# EAGLE design Mergen Ground Station_V2.0 (EAGLE 9.6.2)

## Sheet 1 of 5
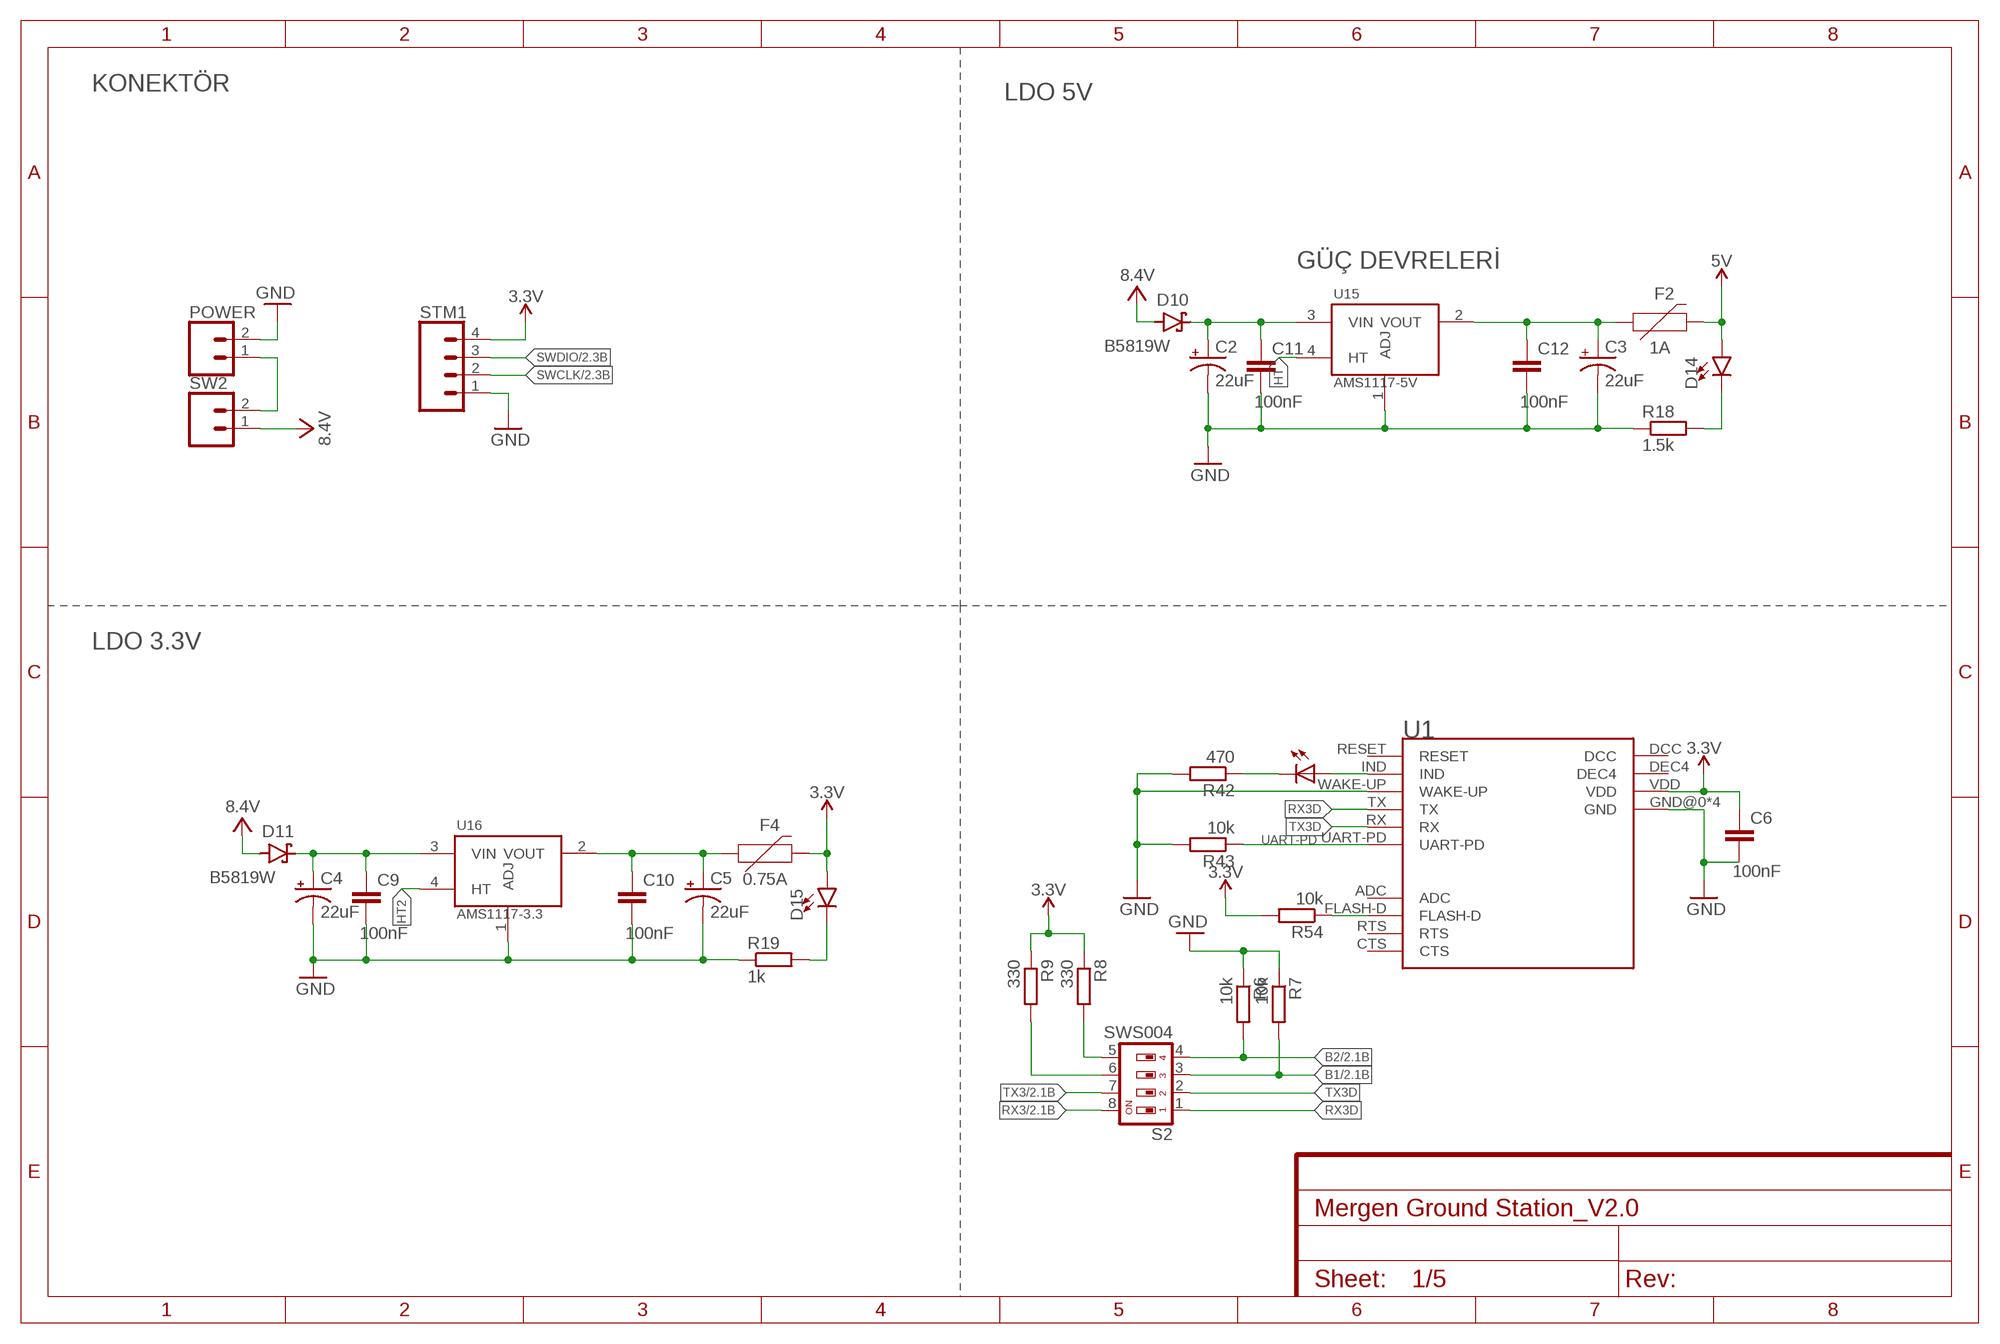
[diagram p0: schematic, sheet 1]

### Parts
C2  22uF  CPOL-USCT3528  [CT3528]
C3  22uF  CPOL-USCT3528  [CT3528]
C4  22uF  CPOL-USCT3528  [CT3528]
C5  22uF  CPOL-USCT3528  [CT3528]
C6  100nF  C-EUC0603  [C0603]
C9  100nF  C-EUC0603  [C0603]
C10  100nF  C-EUC0603  [C0603]
C11  100nF  C-EUC0603  [C0603]
C12  100nF  C-EUC0603  [C0603]
D10  B5819W  SCHOTTKY_MBR0520LT1GDO-219  [SODFL3718X115]
D11  B5819W  SCHOTTKY_MBR0520LT1GDO-219  [SODFL3718X115]
D14  LED0603  [LED-0603]
D15  LED0603  [LED-0603]
DRM3  kirmizi  LEDCHIP-LED0805  [CHIP-LED0805]
F2  1A  PPTC_HALF-AMP  [1206]
F4  0.75A  PPTC_HALF-AMP  [1206]
POWER  CONN_023.5MM-NO_SILK  [SCREWTERMINAL-3.5MM-2-NS]
R6  10k  R-EU_R0603  [R0603]
R7  10k  R-EU_R0603  [R0603]
R8  330  R-EU_R0603  [R0603]
R9  330  R-EU_R0603  [R0603]
R18  1.5k  R-EU_R0603  [R0603]
R19  1k  R-EU_R0603  [R0603]
R42  470  R-EU_R0603  [R0603]
R43  10k  R-EU_R0603  [R0603]
R54  10k  R-EU_R0603  [R0603]
S2  SWS004  [SMS-004]
STM1  CONN_04  [1X04]
SW2  CONN_023.5MM-NO_SILK  [SCREWTERMINAL-3.5MM-2-NS]
U1  MDBT42T-AT  [MDBT42T-AT]
U15  AMS1117-5V  AMS1117-3.3  [SOT229P700X180-4N]
U16  AMS1117-3.3  [SOT229P700X180-4N]

### Nets
3.3V: C6.1 D15.A F4.2 R8.1 R9.1 R54.2 STM1.4 U1.VDD ; also sheet 2,3,5
5V: D14.A F2.2 ; also sheet 4,5
B1: R7.2 S2.3 ; also sheet 2
B2: R6.2 S2.4 ; also sheet 2
FLASH-D: R54.1 U1.FLASH-D ; also sheet 2
GND: C2.- C3.- C4.- C5.- C6.2 C9.2 C10.2 C11.2 C12.2 POWER.2 R6.1 R7.1 R18.1 R19.1 R42.2 R43.2 STM1.1 U1.GND@0(GND) U1.GND@1(GND) U1.GND@2(GND) U1.GND@3(GND) U1.WAKE-UP U15.1(ADJ) U16.1(ADJ) ; also sheet 2,3,4,5
HT: U15.4(HT)
HT2: U16.4(HT)
N$5: DRM3.A U1.IND
N$6: DRM3.C R42.1
N$7: R9.2 S2.6
N$8: R8.2 S2.5
N$22: C2.+ C11.1 D10.1(C) U15.3(VIN)
N$23: C3.+ C12.1 F2.1 U15.2(VOUT)
N$24: C4.+ C9.1 D11.1(C) U16.3(VIN)
N$25: C5.+ C10.1 F4.1 U16.2(VOUT)
N$30: POWER.1 SW2.2
N$35: D14.C R18.2
N$36: D15.C R19.2
RX3: S2.8 ; also sheet 2,5
RX3D: S2.1 U1.TX
SWCLK: STM1.2 ; also sheet 2
SWDIO: STM1.3 ; also sheet 2
TX3: S2.7 ; also sheet 2,5
TX3D: S2.2 U1.RX
UART-PD: R43.1 U1.UART-PD ; also sheet 2
VCC: D10.2(A) D11.2(A) SW2.1 ; supply symbol labelled 8.4V ; also sheet 2,5
Unconnected: U1.ADC U1.CTS U1.DCC U1.DEC4 U1.RESET U1.RTS

### Notes on the sheet
- KONEKTÖR
- LDO 5V
- GÜÇ DEVRELERİ
- LDO 3.3V

## Sheet 2 of 5
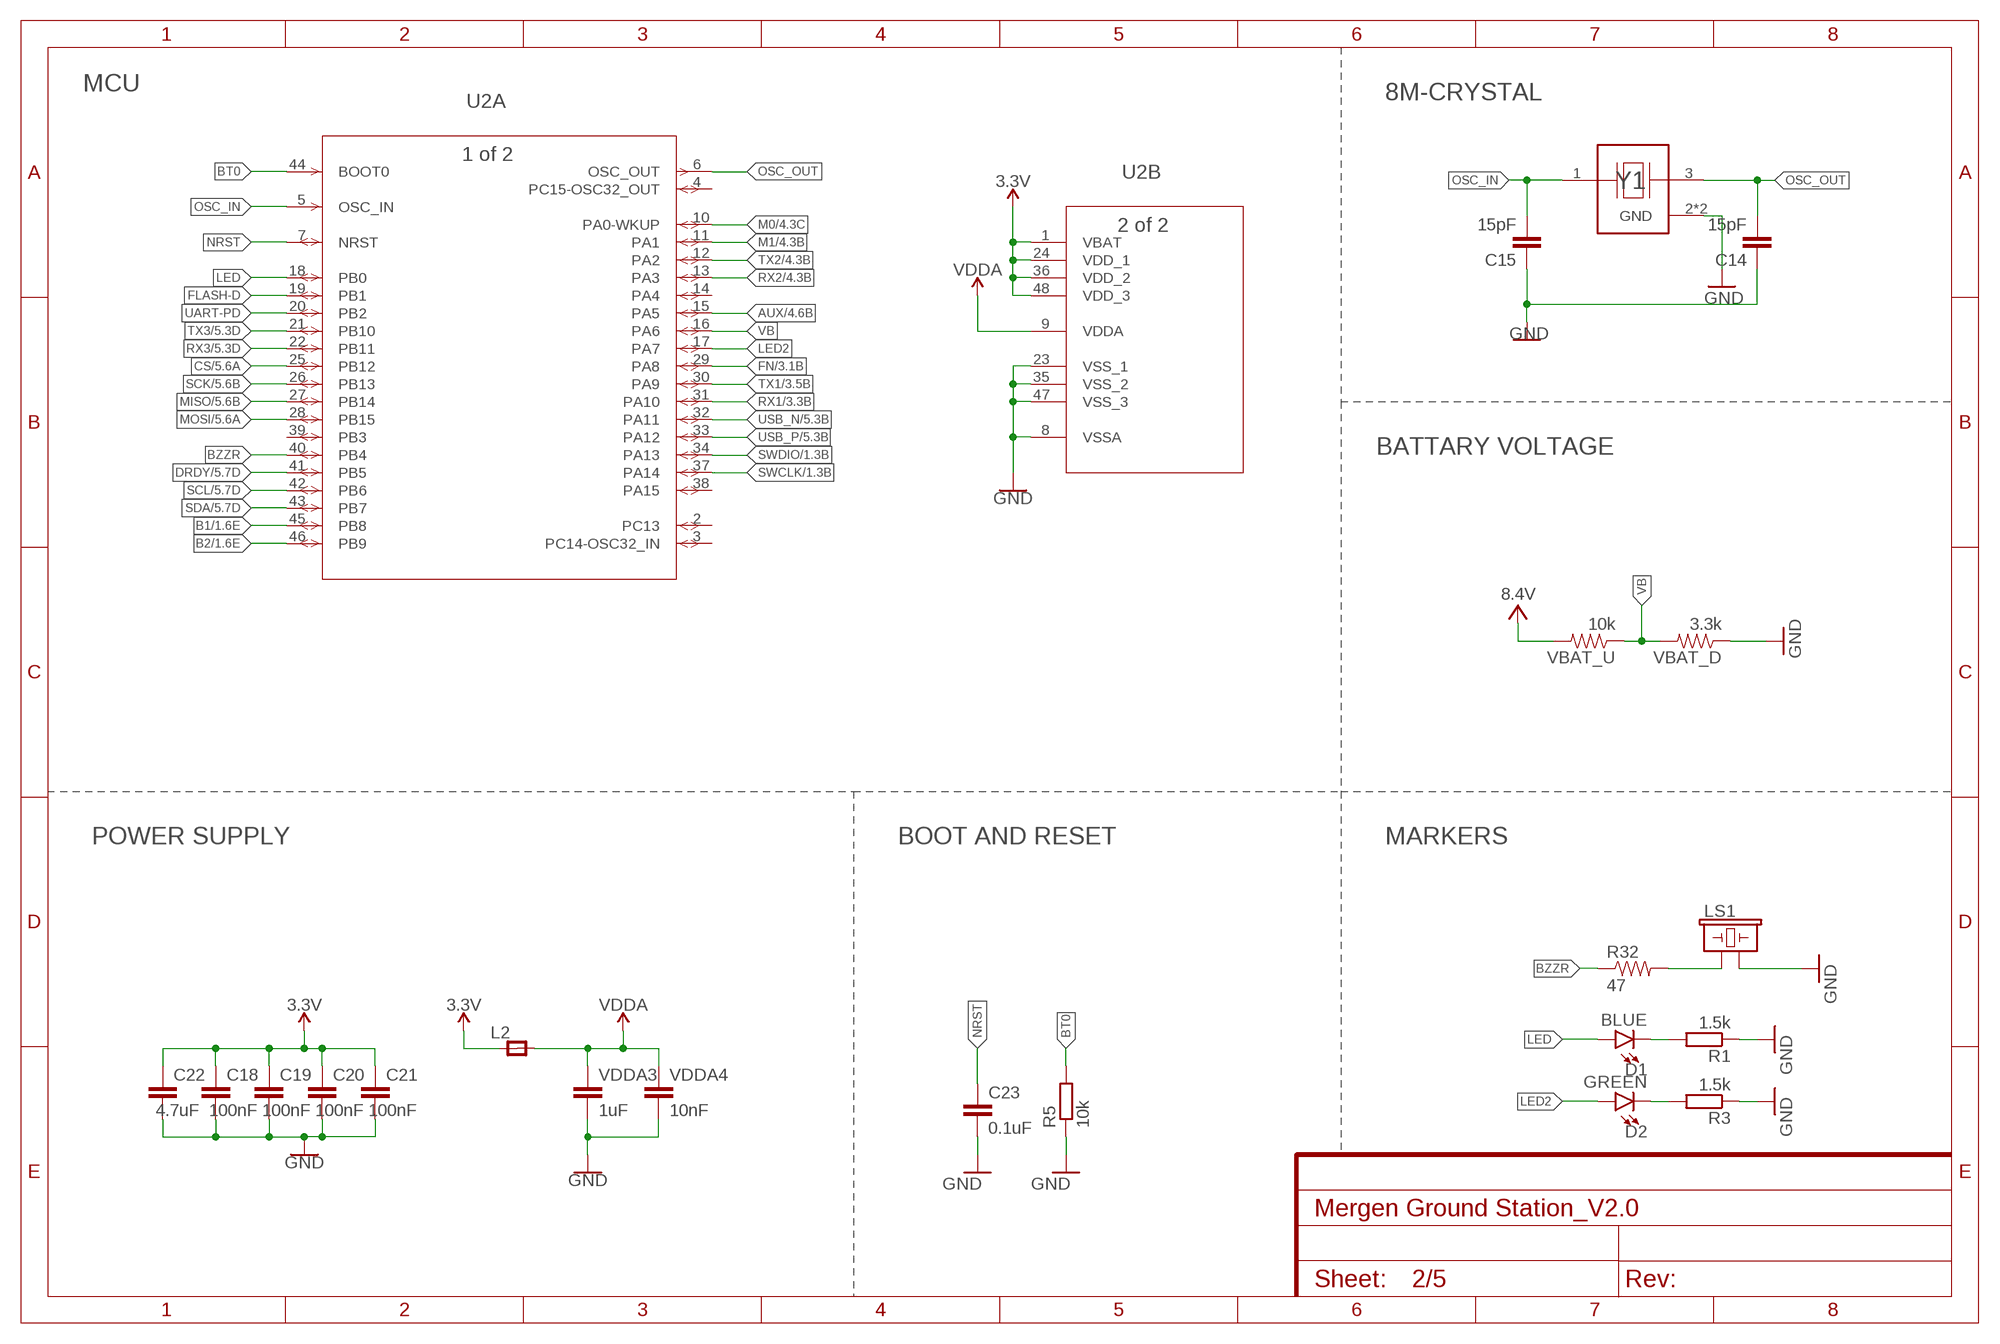
[diagram p1: schematic, sheet 2]

### Parts
C14  15pF  C-EUC0603  [C0603]
C15  15pF  C-EUC0603  [C0603]
C18  100nF  C-EUC0603  [C0603]
C19  100nF  C-EUC0603  [C0603]
C20  100nF  C-EUC0603  [C0603]
C21  100nF  C-EUC0603  [C0603]
C22  4.7uF  C-EUC0603  [C0603]
C23  0.1uF  C-EUC0603  [C0603]
D1  BLUE  LED0603  [LED-0603]
D2  GREEN  LED0603  [LED-0603]
L2  RC-MASTER-SMD_FB_0805MP  [RC-MASTER-SMD_L0805MP]
LS1  BUZZER-PTH  [BUZZER-12MM]
R1  1.5k  R-EU_R0603  [R0603]
R3  1.5k  R-EU_R0603  [R0603]
R5  10k  R-EU_R0603  [R0603]
R32  47  0OHM-0603-1/10W-5%  [0603]
U2  STM32F103C8T6  [LQFP48-7X7MM]
VBAT_D  3.3k  2.0KOHM1/10W5%(0603)  [0603-RES]
VBAT_U  10k  2.0KOHM1/10W5%(0603)  [0603-RES]
VDDA3  1uF  0.1UF-0603-25V-(+80/-20%)  [0603]
VDDA4  10nF  0.1UF-0603-25V-(+80/-20%)  [0603]
Y1  ABMM2-8.000MHZ-E2-T  [XTAL_ABMM2-8.000MHZ-E2-T]

### Nets
3.3V: C18.1 C19.1 C20.1 C21.1 C22.1 L2.1 U2.1(B:VBAT) U2.24(B:VDD_1) U2.36(B:VDD_2) U2.48(B:VDD_3) ; also sheet 1,3,5
AUX: U2.15(A:PA5) ; also sheet 4
B1: U2.45(A:PB8) ; also sheet 1
B2: U2.46(A:PB9) ; also sheet 1
BT0: R5.2 U2.44(A:BOOT0)
BZZR: R32.1 U2.40(A:PB4)
CS: U2.25(A:PB12) ; also sheet 5
DRDY: U2.41(A:PB5) ; also sheet 5
FLASH-D: U2.19(A:PB1) ; also sheet 1
FN: U2.29(A:PA8) ; also sheet 3
GND: C14.1 C15.1 C18.2 C19.2 C20.2 C21.2 C22.2 C23.2 LS1.- R1.1 R3.1 R5.1 U2.8(B:VSSA) U2.23(B:VSS_1) U2.35(B:VSS_2) U2.47(B:VSS_3) VBAT_D.1 VDDA3.2 VDDA4.2 Y1.2(GND) Y1.4(GND) ; also sheet 1,3,4,5
LED: D1.A U2.18(A:PB0)
LED2: D2.A U2.17(A:PA7)
M0: U2.10(A:PA0-WKUP) ; also sheet 4
M1: U2.11(A:PA1) ; also sheet 4
MISO: U2.27(A:PB14) ; also sheet 5
MOSI: U2.28(A:PB15) ; also sheet 5
N$1: D1.C R1.2
N$3: D2.C R3.2
N$4: LS1.+ R32.2
NRST: C23.1 U2.7(A:NRST)
OSC_IN: C15.2 U2.5(A:OSC_IN) Y1.1
OSC_OUT: C14.2 U2.6(A:OSC_OUT) Y1.3
RX1: U2.31(A:PA10) ; also sheet 3
RX2: U2.13(A:PA3) ; also sheet 4
RX3: U2.22(A:PB11) ; also sheet 1,5
SCK: U2.26(A:PB13) ; also sheet 5
SCL: U2.42(A:PB6) ; also sheet 5
SDA: U2.43(A:PB7) ; also sheet 5
SWCLK: U2.37(A:PA14) ; also sheet 1
SWDIO: U2.34(A:PA13) ; also sheet 1
TX1: U2.30(A:PA9) ; also sheet 3
TX2: U2.12(A:PA2) ; also sheet 4
TX3: U2.21(A:PB10) ; also sheet 1,5
UART-PD: U2.20(A:PB2) ; also sheet 1
USB_N: U2.32(A:PA11) ; also sheet 5
USB_P: U2.33(A:PA12) ; also sheet 5
VB: U2.16(A:PA6) VBAT_D.2 VBAT_U.1
VCC: VBAT_U.2 ; supply symbol labelled 8.4V ; also sheet 1,5
VDDA: L2.2 U2.9(B:VDDA) VDDA3.1 VDDA4.1
Unconnected: U2.2(A:PC13) U2.3(A:PC14-OSC32_IN) U2.4(A:PC15-OSC32_OUT) U2.14(A:PA4) U2.38(A:PA15) U2.39(A:PB3)

### Notes on the sheet
- MCU
- 8M-CRYSTAL
- BATTARY VOLTAGE
- POWER SUPPLY | BOOT AND RESET | MARKERS

## Sheet 3 of 5
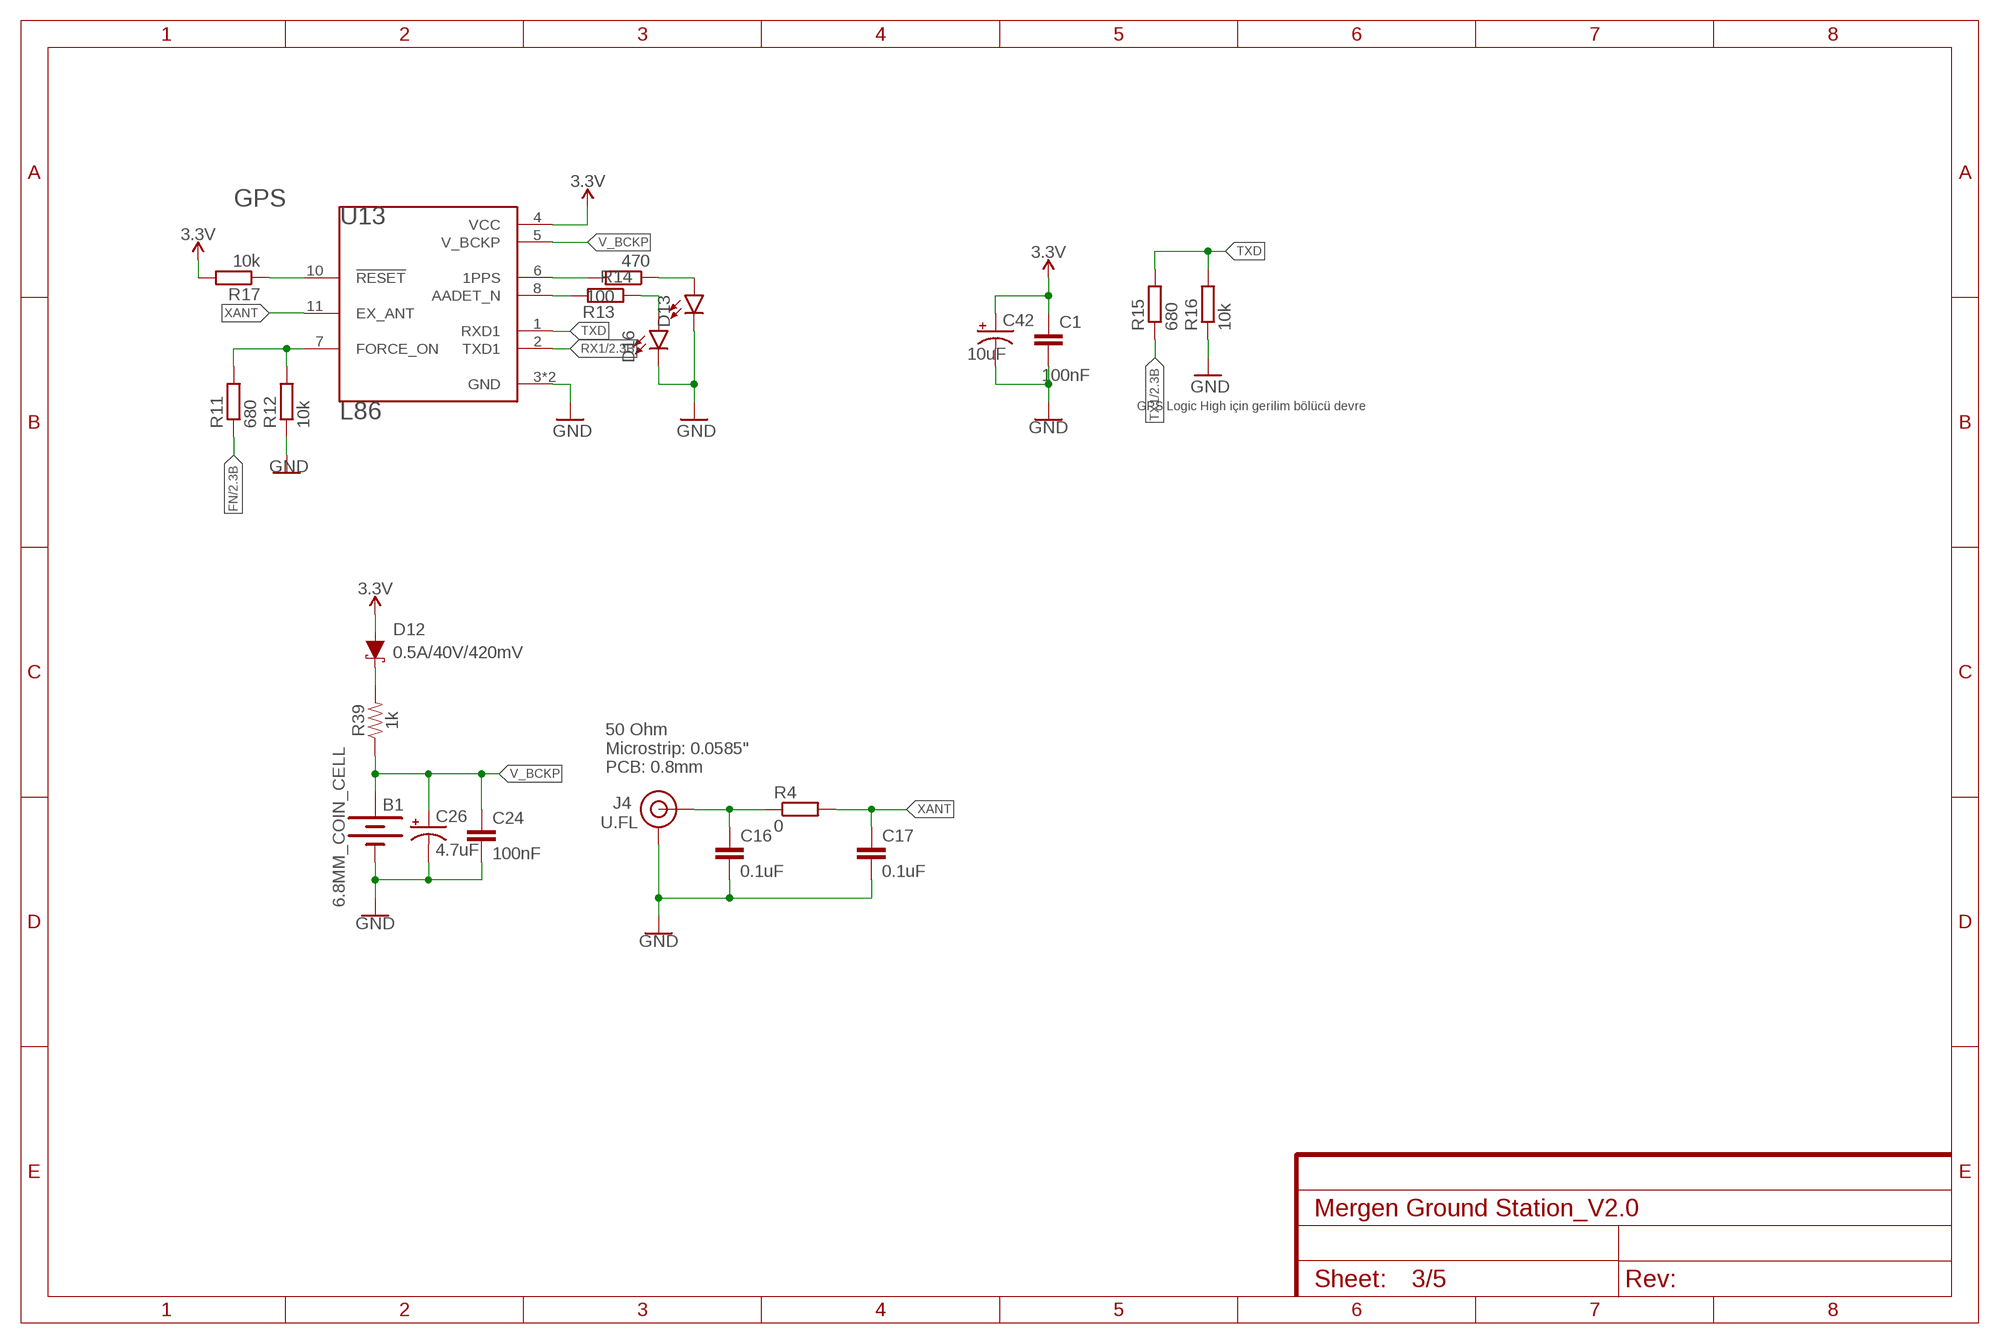
[diagram p2: schematic, sheet 3]

### Parts
B1  6.8MM_COIN_CELL  BATTERY-6.8MM_SMD  [BATTCON-6.8MM]
C1  100nF  C-EUC0603  [C0603]
C16  0.1uF  C-EUC0603  [C0603]
C17  0.1uF  C-EUC0603  [C0603]
C24  100nF  C-EUC0603  [C0603]
C26  4.7uF  CPOL-USA/3216-18R  [A/3216-18R]
C42  10uF  10UF-POLAR-EIA3216-16V-10%(TANT)  [EIA3216]
D12  0.5A/40V/420mV  DIODE-SCHOTTKY-PMEG4005EJ  [SOD-323]
D13  LED0603  [LED-0603]
D16  LED0603  [LED-0603]
J4  U.FL  U.FL2PIN  [U.FL]
R4  0  R-EU_R0603  [R0603]
R11  680  R-EU_R0603  [R0603]
R12  10k  R-EU_R0603  [R0603]
R13  100  R-EU_R0603  [R0603]
R14  470  R-EU_R0603  [R0603]
R15  680  R-EU_R0603  [R0603]
R16  10k  R-EU_R0603  [R0603]
R17  10k  R-EU_R0603  [R0603]
R39  1k  1KOHM-0603-1/10W-1%  [0603]
U13  L86  [XCVR_L86]

### Nets
3.3V: C1.1 C42.+ D12.A R17.2 U13.4(VCC) ; also sheet 1,2,5
FN: R11.1 ; also sheet 2
GND: B1.- C1.2 C16.2 C17.2 C24.2 C26.- C42.- D13.C D16.C J4.1(GND) J4.2(GND) R12.1 R16.1 U13.3(GND) U13.12(GND) ; also sheet 1,2,4,5
N$2: D16.A R13.1
N$31: D12.C R39.2
N$32: R17.1 U13.10(!RESET)
N$33: R14.2 U13.6(1PPS)
N$34: D13.A R14.1
N$37: R13.2 U13.8(AADET_N)
N$39: C16.1 J4.FEED(SIGNAL) R4.1
N$40: R11.2 R12.2 U13.7(FORCE_ON)
RX1: U13.2(TXD1) ; also sheet 2
TX1: R15.1 ; also sheet 2
TXD: R15.2 R16.2 U13.1(RXD1)
V_BCKP: B1.+ C24.1 C26.+ R39.1 U13.5(V_BCKP)
XANT: C17.1 R4.2 U13.11(EX_ANT)

### Notes on the sheet
- GPS
- GPS Logic High için gerilim bölücü devre
- 50 Ohm 
  Microstrip: 0.0585"
  PCB: 0.8mm

## Sheet 4 of 5
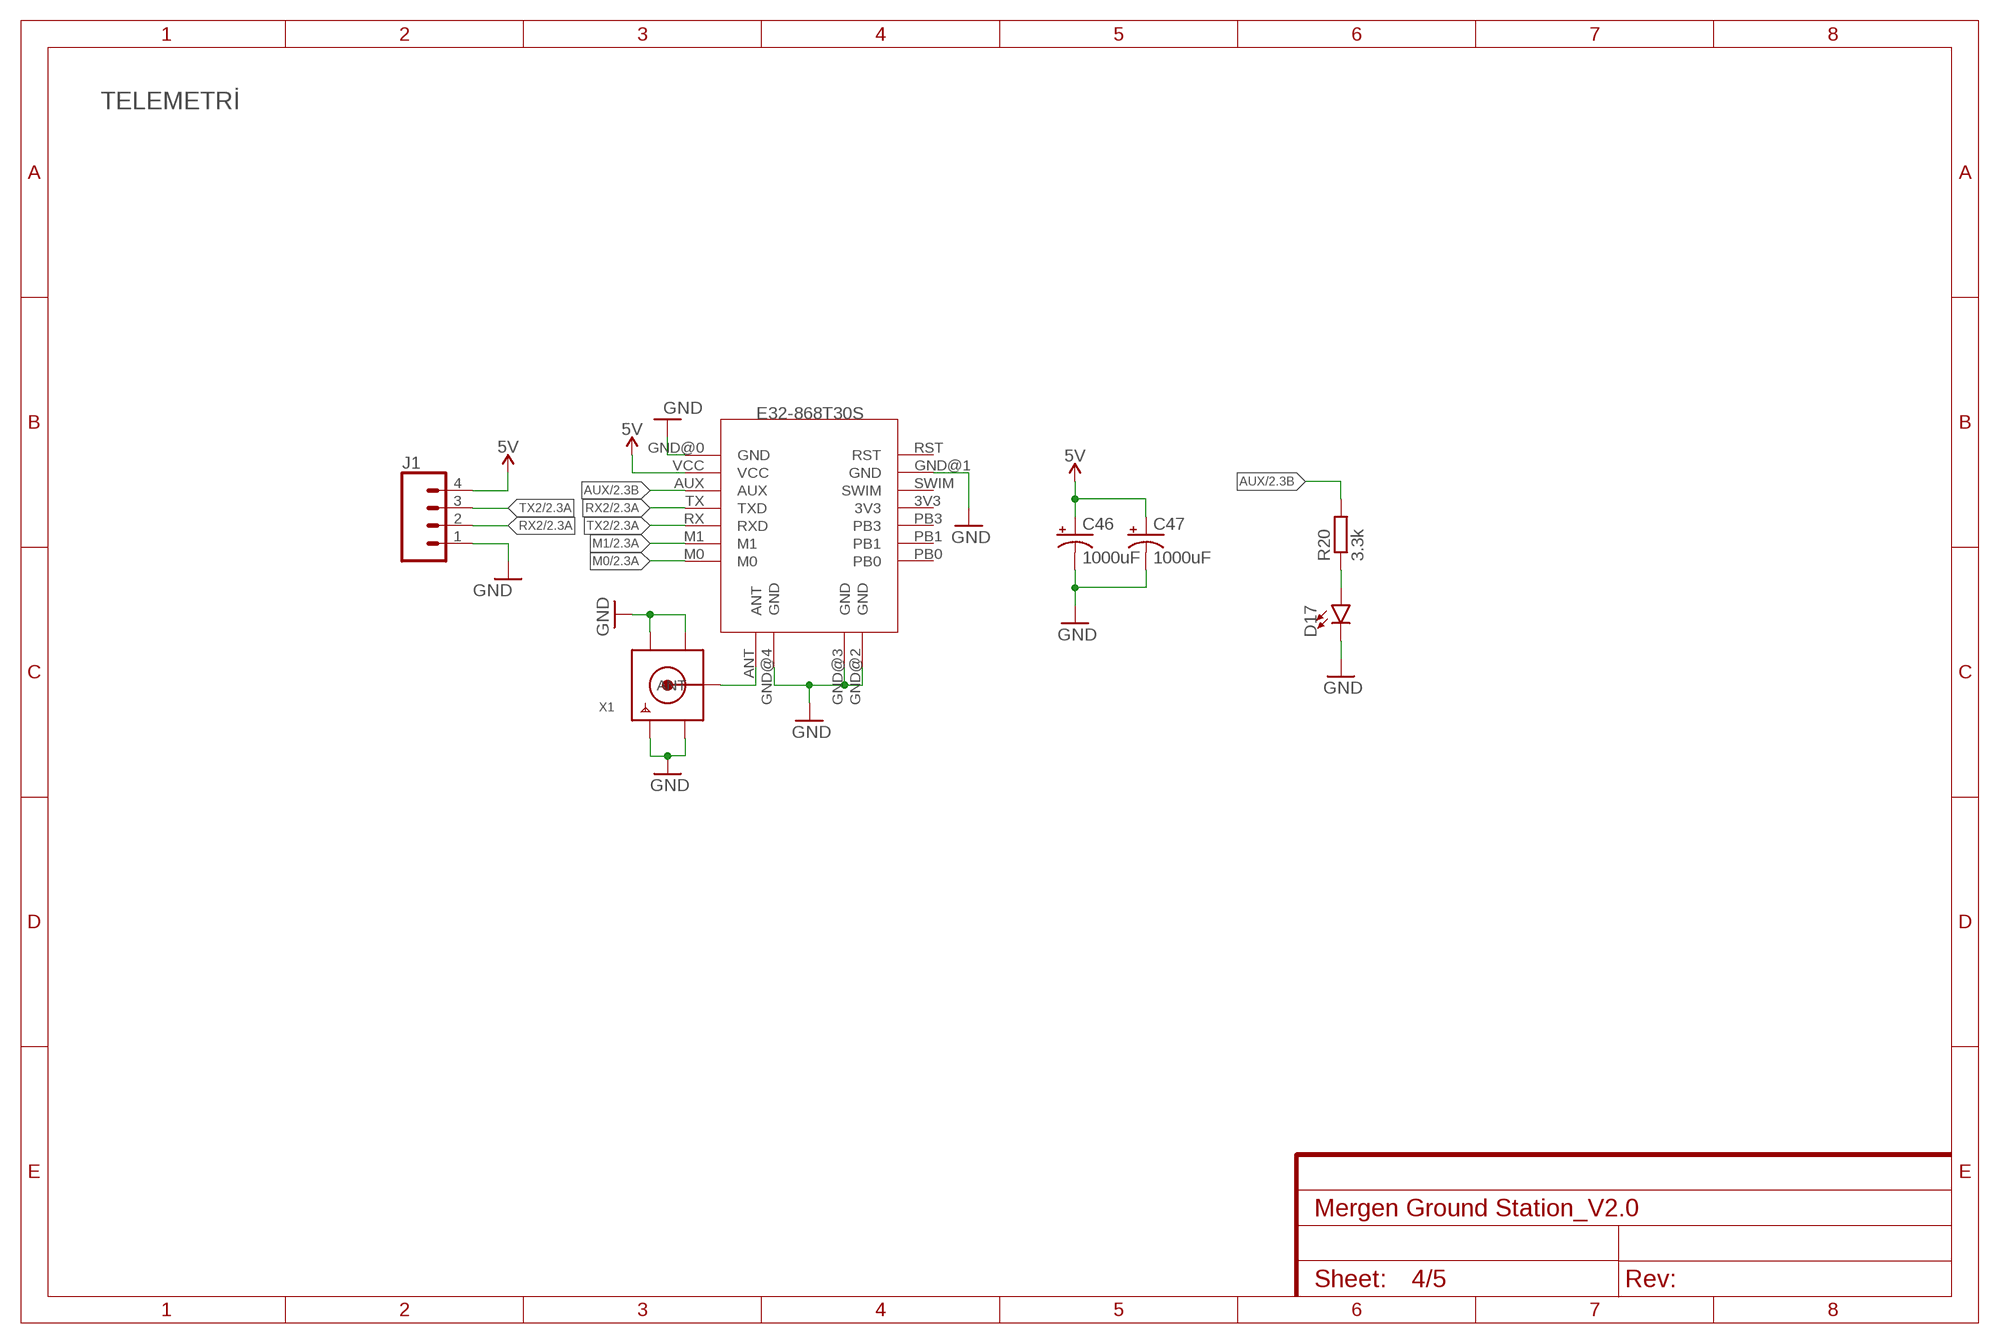
[diagram p3: schematic, sheet 4]

### Parts
C46  1000uF  CPOL-US150CLZ-1010  [150CLZ-1010]
C47  1000uF  CPOL-US150CLZ-1010  [150CLZ-1010]
D17  LED0603  [LED-0603]
J1  CONN_04  [1X04]
R20  3.3k  R-EU_R0603  [R0603]
U14  E32-868T30S  [E32-868T30S]
X1  SMACONNECTOR  [SMA90_DIP]

### Nets
5V: C46.+ C47.+ J1.4 U14.VCC ; also sheet 1,5
AUX: R20.2 U14.AUX ; also sheet 2
GND: C46.- C47.- D17.C J1.1 U14.GND@0(GND) U14.GND@1(GND) U14.GND@2(GND) U14.GND@3(GND) U14.GND@4(GND) X1.GND1 X1.GND2 X1.GND3 X1.GND4 ; also sheet 1,2,3,5
M0: U14.M0 ; also sheet 2
M1: U14.M1 ; also sheet 2
N$27: U14.ANT X1.ANTENNA(ANT)
N$41: D17.A R20.1
RX2: J1.2 U14.TX(TXD) ; also sheet 2
TX2: J1.3 U14.RX(RXD) ; also sheet 2
Unconnected: U14.3V3 U14.PB0 U14.PB1 U14.PB3 U14.RST U14.SWIM

### Notes on the sheet
- TELEMETRİ

## Sheet 5 of 5
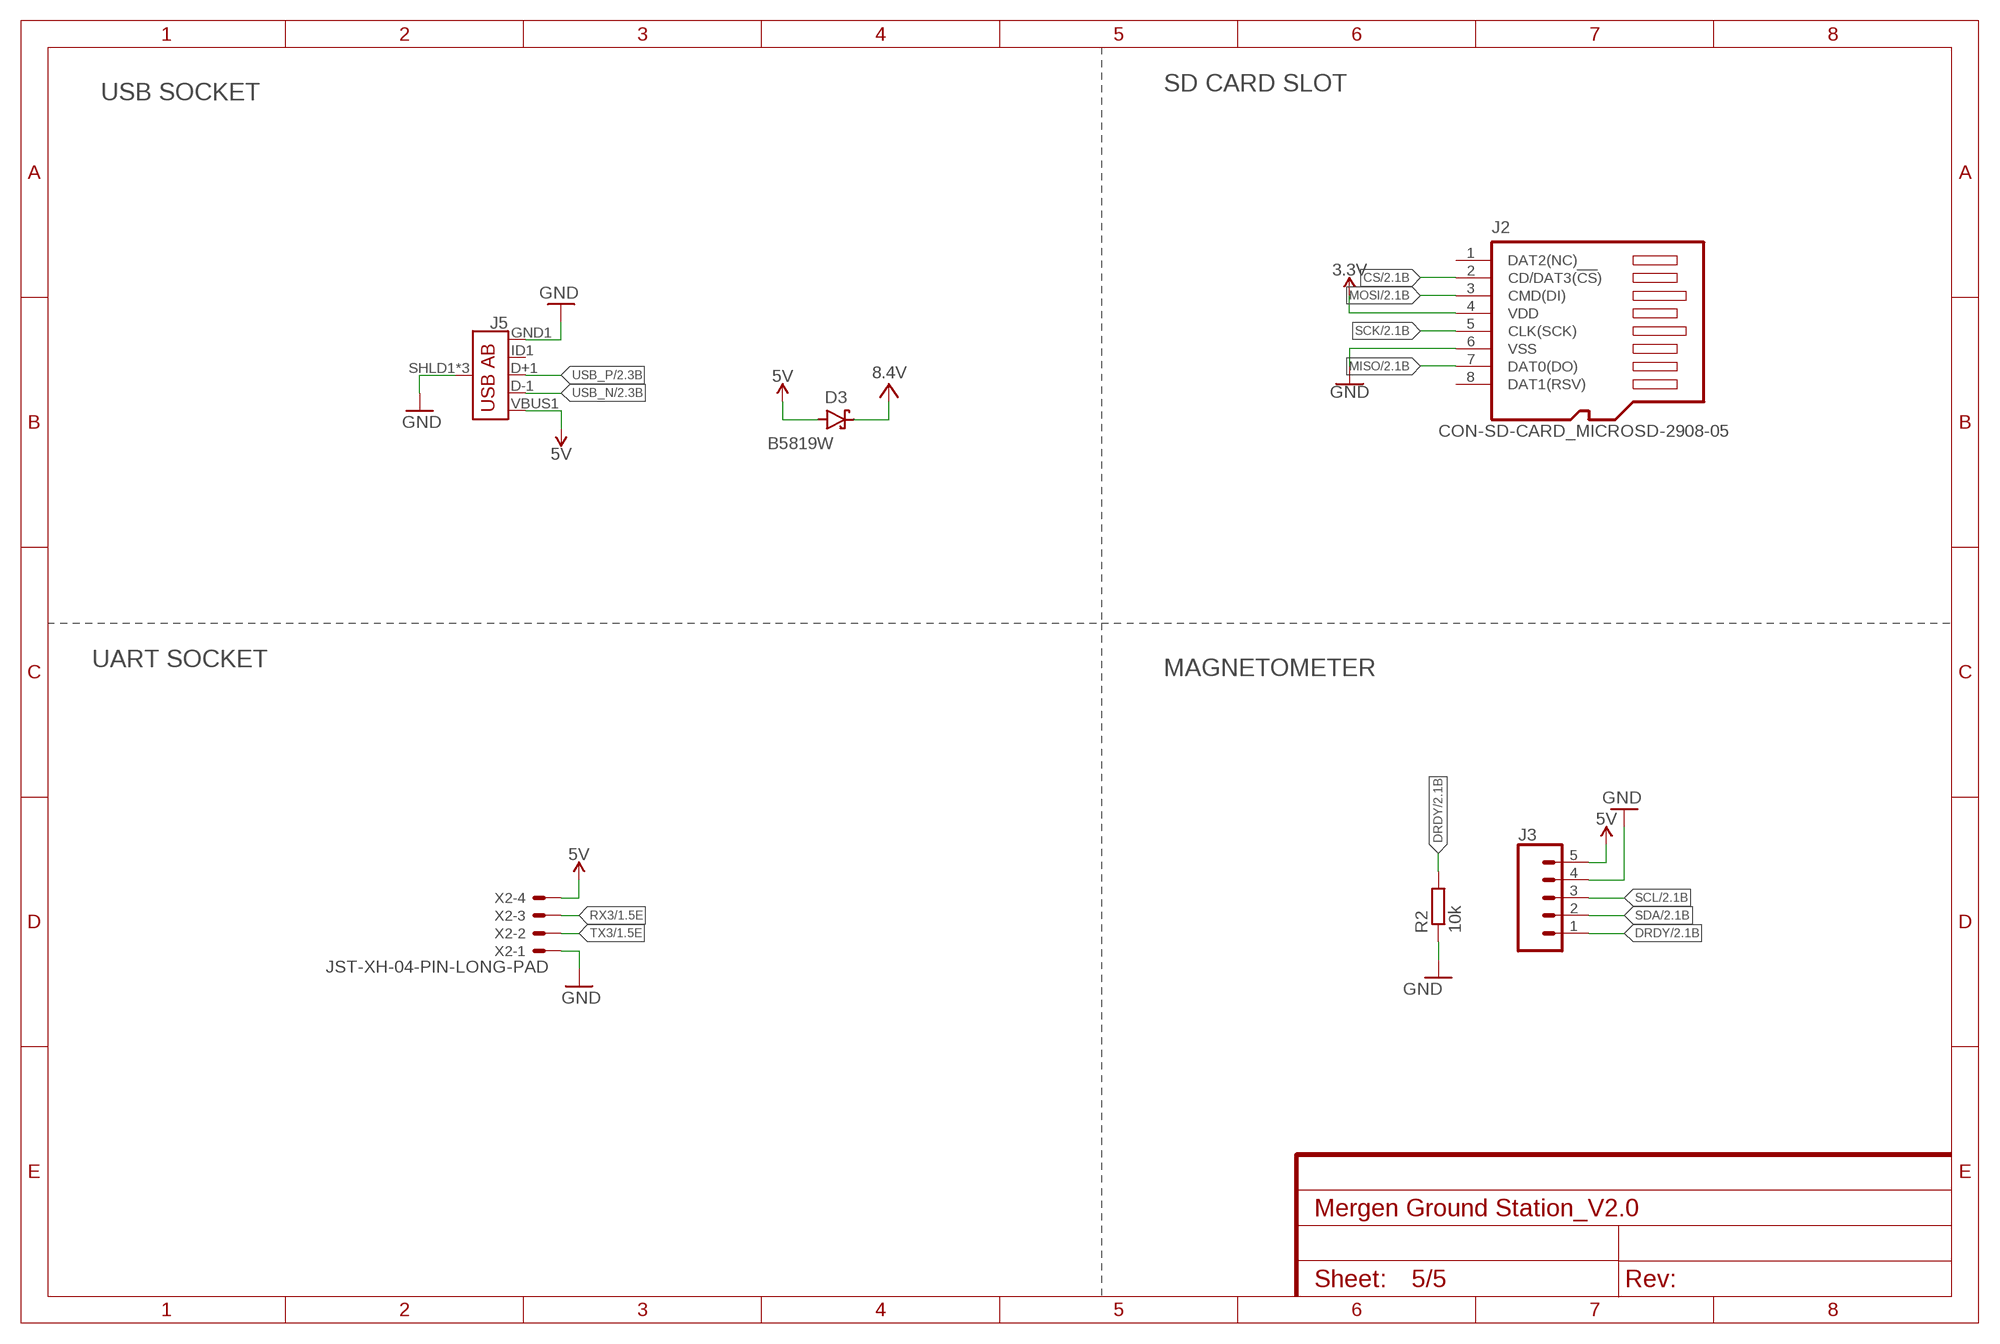
[diagram p4: schematic, sheet 5]

### Parts
D3  B5819W  SCHOTTKY_MBR0520LT1GDO-219  [SODFL3718X115]
J2  CON-SD-CARD_MICROSD-2908-05  [CON-SD-CARD_2908-05]
J3  CONN_05LOCK_LONGPADS  [1X05_LOCK_LONGPADS]
J5  USB_AB_SMT  [USB-AB-MICRO-SMD]
R2  10k  R-EU_R0603  [R0603]
X2  JST-XH-04-PIN-LONG-PAD  [JST-XH-04-PACKAGE-LONG-PAD]

### Nets
3.3V: J2.4(VDD) ; also sheet 1,2,3
5V: D3.2(A) J3.5 J5.VBUS1(VBUS) X2.4 ; also sheet 1,4
CS: J2.2(CD/DAT3(!CS!)) ; also sheet 2
DRDY: J3.1 R2.2 ; also sheet 2
GND: J2.6(VSS) J3.4 J5.GND1(GND) J5.SHLD1(SHIELD) J5.SHLD2(SHIELD) J5.SHLD3(SHIELD) R2.1 X2.1 ; also sheet 1,2,3,4
MISO: J2.7(DAT0(DO)) ; also sheet 2
MOSI: J2.3(CMD(DI)) ; also sheet 2
RX3: X2.3 ; also sheet 1,2
SCK: J2.5(CLK(SCK)) ; also sheet 2
SCL: J3.3 ; also sheet 2
SDA: J3.2 ; also sheet 2
TX3: X2.2 ; also sheet 1,2
USB_N: J5.D-1(D-) ; also sheet 2
USB_P: J5.D+1(D+) ; also sheet 2
VCC: D3.1(C) ; supply symbol labelled 8.4V ; also sheet 1,2
Unconnected: J2.1(DAT2(NC)) J2.8(DAT1(RSV)) J2.GND@1(GND) J2.GND@2(GND) J2.GND@3(GND) J2.GND@4(GND) J5.ID1(USBID)

### Notes on the sheet
- SD CARD SLOT
- USB SOCKET
- UART SOCKET
- MAGNETOMETER

## Library data of the parts
B1 = SparkFun-Batteries:BATTERY: Battery - Single Cell A variety of battery chemistries, sizes, and footprints. Device List: 20MM_PTH - Coin Cell Battery Holder - 20mm (PTH) <https://www.sparkfun.com/products/783> 6.8MM_PTH - Coin Cell Battery Holder - 6.8MM(SMD) <https://www.digikey.com/product-detail/en/seiko-instruments/MS621FE-FL11E/728-1057-ND/1889208?WT.srch=1&gclid=CNOQ5a6LzdQCFZS2wAodXCkE0g> 12MM_SMD - Coin Cell Battery Holder - 12mm (SMD) <https://www.sparkfun.com/products/10592> 12MM_PTH - Coin Cell Battery Holder - 12mm (PTH) <https://www.sparkfun.com/products/7948> 20MM_SMD - 20mm Coin Cell Battery Holder (SMD) (2 legs) Used on the Big Time Watch Kit <https://www.sparkfun.com/products/11734> 20MM_SMD_4LEGS - Coin Cell Battery Holder - 20mm (SMD) <https://www.sparkfun.com/products/11892> 20MM_SMD_4LEGS_OVERPASTE - Coin Cell Battery Holder - 20mm (SMD) <https://www.sparkfun.com/products/11892> (Over-paste on the legs) 24.5MM_PTH - Coin Cell Battery Holder - 24.5mm (PTH) <https://www.sparkfun.com/products/8863> 9V - 9V Battery Holder - PC Mount Used on the SparkFun SparkPunk Sound Kit <https://www.sparkfun.com/products/11177> and SparkFun SparkPunk Sequencer Kit <https://www.sparkfun.com/products/12707> 18650 - Battery Holder - 18650 (PTH) <https://www.sparkfun.com/products/13113> AA - Battery Holder - 1xAA (PTH) <https://www.sparkfun.com/products/7949> AAA - Battery Holder - 1xAAA (PTH) <https://www.sparkfun.com/products/12718> AA_KIT - Battery Holder - 1xAA (PTH) <https://www.sparkfun.com/products/7949> Special kit package - pads only have exposed copper on one side of the board. AAA_KIT - Battery Holder - 1xAAA (PTH) <https://www.sparkfun.com/products/12718> Special kit package - pads only have exposed copper on one side of the board.; PROD_ID: BATT-13734
C1 C6 C9-C12 C14-C24 = rcl:C-EU: CAPACITOR, European symbol; SPICEPREFIX: C
C2-C5 C26 = rcl:CPOL-US: POLARIZED CAPACITOR, American symbol; SPICEPREFIX: C
C42 = SparkFun-Capacitors:10UF-POLAR: 10.0µF polarized capacitors A capacitor is a passive two-terminal electrical component used to store electrical energy temporarily in an electric field.; PROD_ID: CAP-00811
C46 C47 = adafruit:CPOL-US: POLARIZED CAPACITOR, American symbol
D1 D2 D13-D17 = SparkFun-LED:LED: LED (Generic) Standard schematic elements and footprints for 5mm, 3mm, 1206, and 0603 sized LEDs. Generic LEDs with no color specified.
D3 D10 D11 = Diode:SCHOTTKY_: Schottky Diode - Popular parts; CATEGORY: Diode; DESCRIPTION: DIODE SCHOTTKY 20V 500MA SOD123; MANUFACTURER: ON Semiconductor; MPN: MBR0520LT1G; SUB-CATEGORY: Schottky; VALUE: MBR0520LT1G
D12 = SparkFun-DiscreteSemi:DIODE-SCHOTTKY: Schottky diode A Schottky diode is a semiconductor diode which has a low forward voltage drop and a very fast switching action.; PROD_ID: DIO-10955
DRM3 = led:LED: LED OSRAM: - CHIPLED LG R971, LG N971, LY N971, LG Q971, LY Q971, LO R971, LY R971 LH N974, LH R974 LS Q976, LO Q976, LY Q976 LO Q996 - Hyper CHIPLED LW Q18S LB Q993, LB Q99A, LB R99A - SideLED LS A670, LO A670, LY A670, LG A670, LP A670 LB A673, LV A673, LT A673, LW A673 LH A674 LY A675 LS A676, LA A676, LO A676, LY A676, LW A676 LS A679, LY A679, LG A679 - Hyper Micro SIDELED® LS Y876, LA Y876, LO Y876, LY Y876 LT Y87S - SmartLED LW L88C, LW L88S LB L89C, LB L89S, LG L890 LS L89K, LO L89K, LY L89K LS L896, LA L896, LO L896, LY L896 - TOPLED LS T670, LO T670, LY T670, LG T670, LP T670 LSG T670, LSP T670, LSY T670, LOP T670, LYG T670 LG T671, LOG T671, LSG T671 LB T673, LV T673, LT T673, LW T673 LH T674 LS T676, LA T676, LO T676, LY T676, LB T676, LH T676, LSB T676, LW T676 LB T67C, LV T67C, LT T67C, LS T67K, LO T67K, LY T67K, LW E67C LS E67B, LA E67B, LO E67B, LY E67B, LB E67C, LV E67C, LT E67C LW T67C LS T679, LY T679, LG T679 LS T770, LO T770, LY T770, LG T770, LP T770 LB T773, LV T773, LT T773, LW T773 LH T774 LS E675, LA E675, LY E675, LS T675 LS T776, LA T776, LO T776, LY T776, LB T776 LHGB T686 LT T68C, LB T68C - Hyper Mini TOPLED® LB M676 - Mini TOPLED Santana® LG M470 LS M47K, LO M47K, LY M47K Source: http://www.osram.convergy.de LUXEON: - LUMILED® LXK2-PW12-R00, LXK2-PW12-S00, LXK2-PW14-U00, LXK2-PW14-V00 LXK2-PM12-R00, LXK2-PM12-S00, LXK2-PM14-U00 LXK2-PE12-Q00, LXK2-PE12-R00, LXK2-PE12-S00, LXK2-PE14-T00, LXK2-PE14-U00 LXK2-PB12-K00, LXK2-PB12-L00, LXK2-PB12-M00, LXK2-PB14-N00, LXK2-PB14-P00, LXK2-PB14-Q00 LXK2-PR12-L00, LXK2-PR12-M00, LXK2-PR14-Q00, LXK2-PR14-R00 LXK2-PD12-Q00, LXK2-PD12-R00, LXK2-PD12-S00 LXK2-PH12-R00, LXK2-PH12-S00 LXK2-PL12-P00, LXK2-PL12-Q00, LXK2-PL12-R00 Source: www.luxeon.com KINGBRIGHT: KA-3528ASYC Source: www.kingbright.com
F2 F4 = SparkFun-Fuses:PPTC: Resettable Fuse PPTC Resettable Fuse. Really a sort of resistor with a polymeric positive temperature coefficient whose resistance increases dramatically with an increase in temperature. When heated by the power passing through the resistance rises causing the current to be limited, protecting the circuit. This is achieved by the transition of the polymer from a crystalline to an amorphous state where the conductive carbon separates breaking the conductive pathways found in the cool crystalline structure. When a PPTC cools back down it resumes conducting letting the circuit turn back on. SparkFun Products: SparkFun RedBoard - Programmed with Arduino <https://www.sparkfun.com/products/12757> Pro Micro - 5V/16MHz <https://www.sparkfun.com/products/12640> Arduino Pro 328 - 5V/16MHz <https://www.sparkfun.com/products/10915> MP3 Trigger <https://www.sparkfun.com/products/13720>; PROD_ID: RES-08585; VALUE: 6V/0.5A
J1 STM1 = SparkFun-Connectors:CONN_04: Multi connection point. Often used as Generic Header-pin footprint for 0.1 inch spaced/style header connections On any of the 0.1 inch spaced packages, you can populate with these: Break Away Headers - Straight <https://www.sparkfun.com/products/116> (PRT-00116) Break Away Male Headers - Right Angle <https://www.sparkfun.com/products/553> (PRT-00553) Female Headers <https://www.sparkfun.com/products/115> (PRT-00115) Break Away Headers - Machine Pin <https://www.sparkfun.com/products/117> (PRT-00117) Break Away Female Headers - Swiss Machine Pin <https://www.sparkfun.com/products/743> (PRT-00743) For SCREWTERMINALS and SPRING TERMINALS visit here: Screw Terimnals on SparkFun.com <https://www.sparkfun.com/search/results?term=Screw+Terminals> (5mm/3.5mm/2.54mm spacing) This device is also useful as a general connection point to wire up your design to another part of your project. Our various solder wires solder well into these plated through hole pads. Hook-Up Wire - Assortment (Stranded, 22 AWG) <https://www.sparkfun.com/products/11375> (PRT-11375) Hook-Up Wire - Assortment (Solid Core, 22 AWG) <https://www.sparkfun.com/products/11367> (PRT-11367) View the entire wire category on our website here <https://www.sparkfun.com/categories/141> Special notes: Molex polarized connector foot print use with SKU : PRT-08231 with associated crimp pins and housings. 1MM SMD Version SKU: PRT-10208; PROD_ID: CONN-09696
J2 = 52101-101-REV-A_v16:CON-SD-CARD_MICROSD-: microSD Connector
J3 = SparkFun-Connectors:CONN_05: Multi connection point. Often used as Generic Header-pin footprint for 0.1 inch spaced/style header connections On any of the 0.1 inch spaced packages, you can populate with these: Break Away Headers - Straight <https://www.sparkfun.com/products/116> (PRT-00116) Break Away Male Headers - Right Angle <https://www.sparkfun.com/products/553> (PRT-00553) Female Headers <https://www.sparkfun.com/products/115> (PRT-00115) Break Away Headers - Machine Pin <https://www.sparkfun.com/products/117> (PRT-00117) Break Away Female Headers - Swiss Machine Pin <https://www.sparkfun.com/products/743> (PRT-00743) For SCREWTERMINALS and SPRING TERMINALS visit here: Screw Terimnals on SparkFun.com <https://www.sparkfun.com/search/results?term=Screw+Terminals> (5mm/3.5mm/2.54mm spacing) This device is also useful as a general connection point to wire up your design to another part of your project. Our various solder wires solder well into these plated through hole pads. Hook-Up Wire - Assortment (Stranded, 22 AWG) <https://www.sparkfun.com/products/11375> (PRT-11375) Hook-Up Wire - Assortment (Solid Core, 22 AWG) <https://www.sparkfun.com/products/11367> (PRT-11367) View the entire wire category on our website here <https://www.sparkfun.com/categories/141> Special notes: Molex polarized connector foot print use with SKU : PRT-08231 with associated crimp pins and housings. 1MM SMD Version SKU: PRT-10208
J4 = SparkFun-Connectors:U.FL2PIN: SMD Antenna Connector - U.FL 2mm height, 3.0mm x 3.0mm receptacle size. SparkFun Products: SparkFun WiFi Shield - ESP8266 <https://www.sparkfun.com/products/13287> SparkFun ESP8266 Thing <https://www.sparkfun.com/products/13231> SparkFun MiniGen - Pro Mini Signal Generator Shield <https://www.sparkfun.com/products/11420>; PROD_ID: CONN-09193; SF_ID: WRL-09144
J5 = SparkFun-Connectors:USB_AB: USB Type AB Micro Connector OTG-compatible. 5 pins, 3 shield pins SparkFun Products: IOIO-OTG <https://www.sparkfun.com/products/13613> SparkFun SAMD21 Mini Breakout <https://www.sparkfun.com/products/13664>; PROD_ID: CONN-11794
L2 = 52101-101-REV-A_v16:RC-MASTER-SMD_FB_: FERRITE BEAD
LS1 = SparkFun-Electromechanical:BUZZER: Buzzer Small round buzzers that operate around the audible 2kHz range. You can use these as speakers to create simple music or user interfaces. Variant Overview: PTH - Mini Speaker - PC Mount 12mm 2.048kHz <https://www.sparkfun.com/products/7950> PTH_KIT - Mini Speaker - PC Mount 12mm 2.048kHz <https://www.sparkfun.com/products/7950> KIT simplifies soldering by adding stop mask to one side of the pads. PTH_NO_SILK - Mini Speaker - PC Mount 12mm 2.048kHz <https://www.sparkfun.com/products/7950> No silkscreen indicator of buzzer outline. PTH_KIT_NO_SILK - Mini Speaker - PC Mount 12mm 2.048kHz <https://www.sparkfun.com/products/7950> KIT package w/o silkscreen SMD - Buzzer Audio Magnetic (CCV-084B16) SMD buzzer used on, e.g. the LilyPad Buzzer <https://www.sparkfun.com/products/8463> and RFID USB Reader <https://www.sparkfun.com/products/9963>. SMD_KIT - Buzzer Audio Magnetic (CCV-084B16) SMD Buzzer with elongated pins to make soldering easier. Used on the SparkFun Simon Says - Surface Mount Soldering Kit <https://www.sparkfun.com/products/10935>.; PROD_ID: COMP-08253; SF_SKU: COM-07950
POWER SW2 = SparkFun-Connectors:CONN_02: Multi connection point. Often used as Generic Header-pin footprint for 0.1 inch spaced/style header connections On any of the 0.1 inch spaced packages, you can populate with these: Break Away Headers - Straight <https://www.sparkfun.com/products/116> (PRT-00116) Break Away Male Headers - Right Angle <https://www.sparkfun.com/products/553> (PRT-00553) Female Headers <https://www.sparkfun.com/products/115> (PRT-00115) Break Away Headers - Machine Pin <https://www.sparkfun.com/products/117> (PRT-00117) Break Away Female Headers - Swiss Machine Pin <https://www.sparkfun.com/products/743> (PRT-00743) For SCREWTERMINALS and SPRING TERMINALS visit here: Screw Terimnals on SparkFun.com <https://www.sparkfun.com/search/results?term=Screw+Terminals> (5mm/3.5mm/2.54mm spacing) This device is also useful as a general connection point to wire up your design to another part of your project. Our various solder wires solder well into these plated through hole pads. Hook-Up Wire - Assortment (Stranded, 22 AWG) <https://www.sparkfun.com/products/11375> (PRT-11375) Hook-Up Wire - Assortment (Solid Core, 22 AWG) <https://www.sparkfun.com/products/11367> (PRT-11367) View the entire wire category on our website here <https://www.sparkfun.com/categories/141> Special notes: Molex polarized connector foot print use with: PRT-08233 with associated crimp pins and housings. 2.54_SCREWTERM for use with PRT-10571. 3.5mm Screw Terminal footprints for PRT-08084 5mm Screw Terminal footprints for use with PRT-08432; PROD_ID: CONN-08399
R1-R5 R11-R20 = rcl:R-EU_: RESISTOR, European symbol; SPICEPREFIX: R
R6-R9 R42 R43 R54 = rcl:R-EU_: RESISTOR, European symbol
R32 = SparkFun-Resistors:0OHM: 0Ω resistor A resistor is a passive two-terminal electrical component that implements electrical resistance as a circuit element. Resistors act to reduce current flow, and, at the same time, act to lower voltage levels within circuits. - Wikipedia; PROD_ID: RES-08609; VALUE: 0
R39 = SparkFun-Resistors:1KOHM: 1kΩ resistor A resistor is a passive two-terminal electrical component that implements electrical resistance as a circuit element. Resistors act to reduce current flow, and, at the same time, act to lower voltage levels within circuits. - Wikipedia; PROD_ID: RES-07856
S2 = smd-special:SWS004: SMD Dip Switch 4 pol.
U1 = ELTASSAN:MDBT42T-AT: MODULE BLUETOOTH BT4.2/5 nRF52805 SOC CHIP ANTENNA; COMPONENT: MODULE BLUETOOTH BT4.2/5 nRF52805 SOC CHIP ANTENNA; OZDISAN_NO: MDBT42T-AT
U2 = STM32F103C8T6:STM32F103C8T6; BUILT_BY: EMA_UL_Team; COPYRIGHT: Copyright (C) 2018 Accelerated Designs. All rights reserved; MANUFACTURER_PART_NUMBER: STM32F103C8T6; SOURCELIBRARY: Updates_to_database_2020-10-19; VENDOR: STMicroelectronics
U13 = L86:L86: L86 is an ultra-compact GNSS POT (Patch on Top) module with an embedded 18.4mm × 18.4mm × 4.0mm patch antenna and utilizes the MediaTek new generation GNSS chipset MT3333 that achieves the perfect performance; AVAILABILITY: Unavailable; DESCRIPTION: L86 is an ultra-compact GNSS POT (Patch on Top) module with an embedded 18.4mm × 18.4mm × 4.0mm patch antenna and utilizes the MediaTek new generation GNSS chipset MT3333 that achieves the perfect performance; MF: Quectel; MP: L86; PACKAGE: PowerSFN-8 Quectel; PRICE: None
U14 = E32-868T30S:E32-868T30S: E BYTE E32-868T30S
U15 U16 = AMS1117-3.3:AMS1117-3.3: Sot223/Pkg 1-Amp 3.3-Volt Low Drop Out Voltage Regulatator; AVAILABILITY: Unavailable; DESCRIPTION: Sot223/Pkg 1-Amp 3.3-Volt Low Drop Out Voltage Regulatator; MF: Advanced Monolithic Systems; MP: AMS1117-3.3; PACKAGE: SOT-89 ams; PRICE: None
VBAT_D VBAT_U = SparkFun-Resistors:2.0KOHM1/10W5%(0603): RES-08296; PROD_ID: RES-08296; VALUE: 2.0k
VDDA3 VDDA4 = SparkFun-Capacitors:0.1UF: 0.1µF ceramic capacitors A capacitor is a passive two-terminal electrical component used to store electrical energy temporarily in an electric field.; PROD_ID: CAP-00810; VALUE: 0.1uF
X1 = adafruit:SMACONNECTOR: SMA Connector 90° DIP SMA Connector, 50 Ohm (4UConnector: 07259)
X2 = Rembrandt Electronics - JST XH Connectors v1-0:JST-XH-04-PIN: JST XH Connector 2 Pin Wire to board connector. Pitch: 2,54 mm, (0.100") Number of pins: 4 Created by Rembrandt Electronics www.rembrandtelectronics.com
Y1 = ABMM2-8.000MHZ-E2-T (1):ABMM2-8.000MHZ-E2-T: Check prices <https://pricing.snapeda.com/parts/ABMM2-8.000MHZ-E2-T/Abracon/view-part?ref=eda>; AVAILABILITY: Good; DESCRIPTION: 8MHz ±20ppm Crystal 18pF 72 Ohms 4-SMD, No Lead; MF: Abracon; MP: ABMM2-8.000MHZ-E2-T; PACKAGE: SMD-4 Abracon; PRICE: None; PURCHASE-URL: https://pricing.snapeda.com/search/part/ABMM2-8.000MHZ-E2-T/?ref=eda

## Board
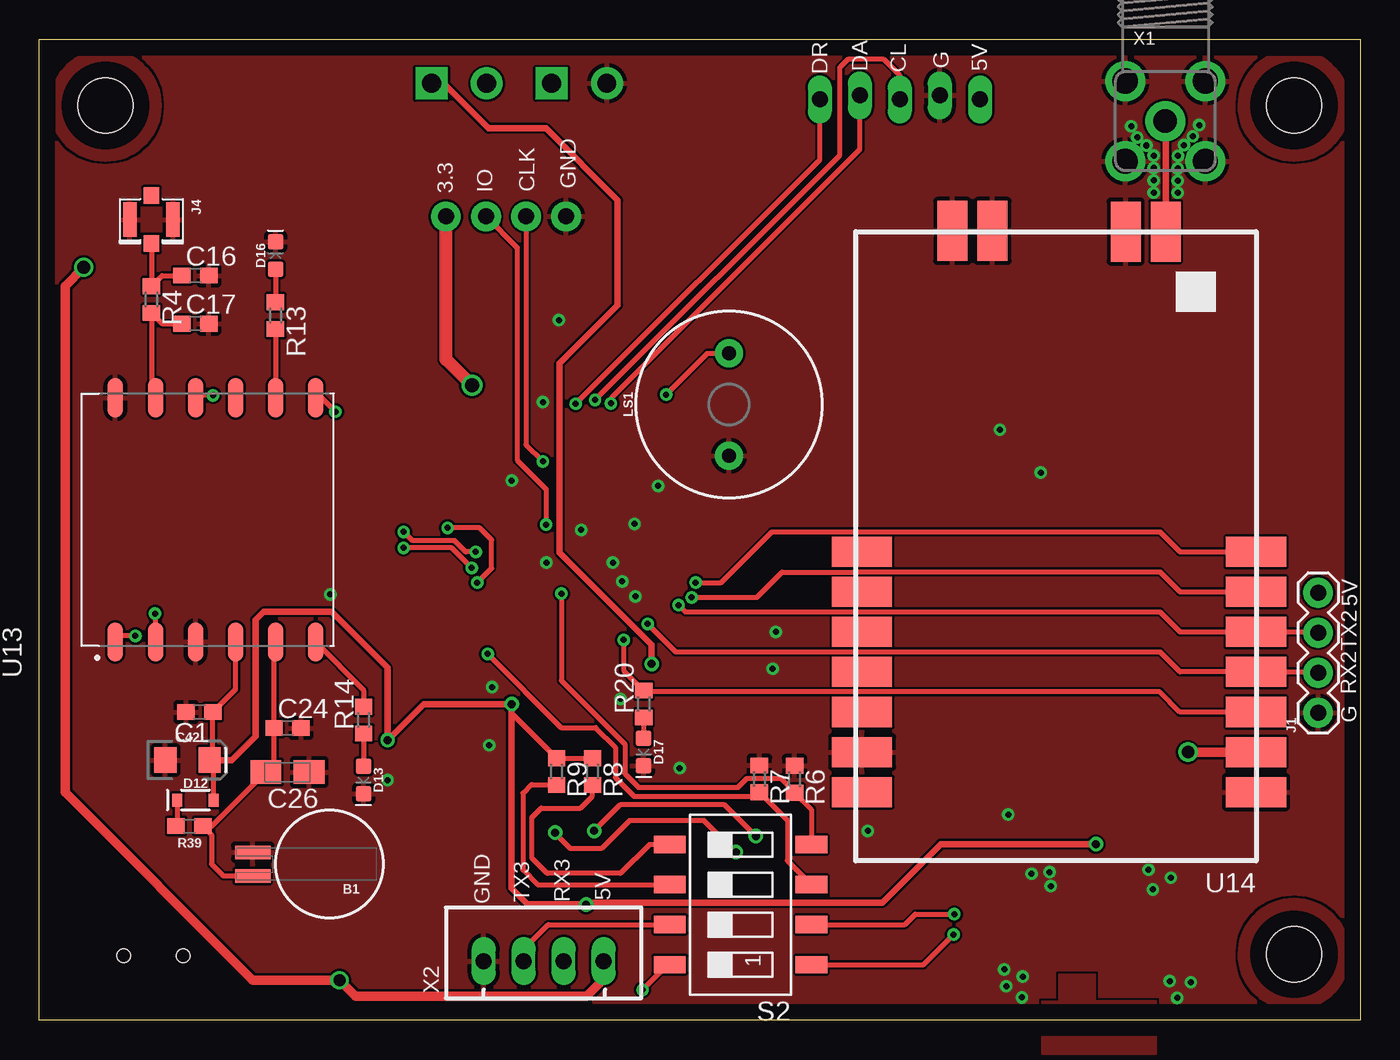
[diagram p5: board, top side]
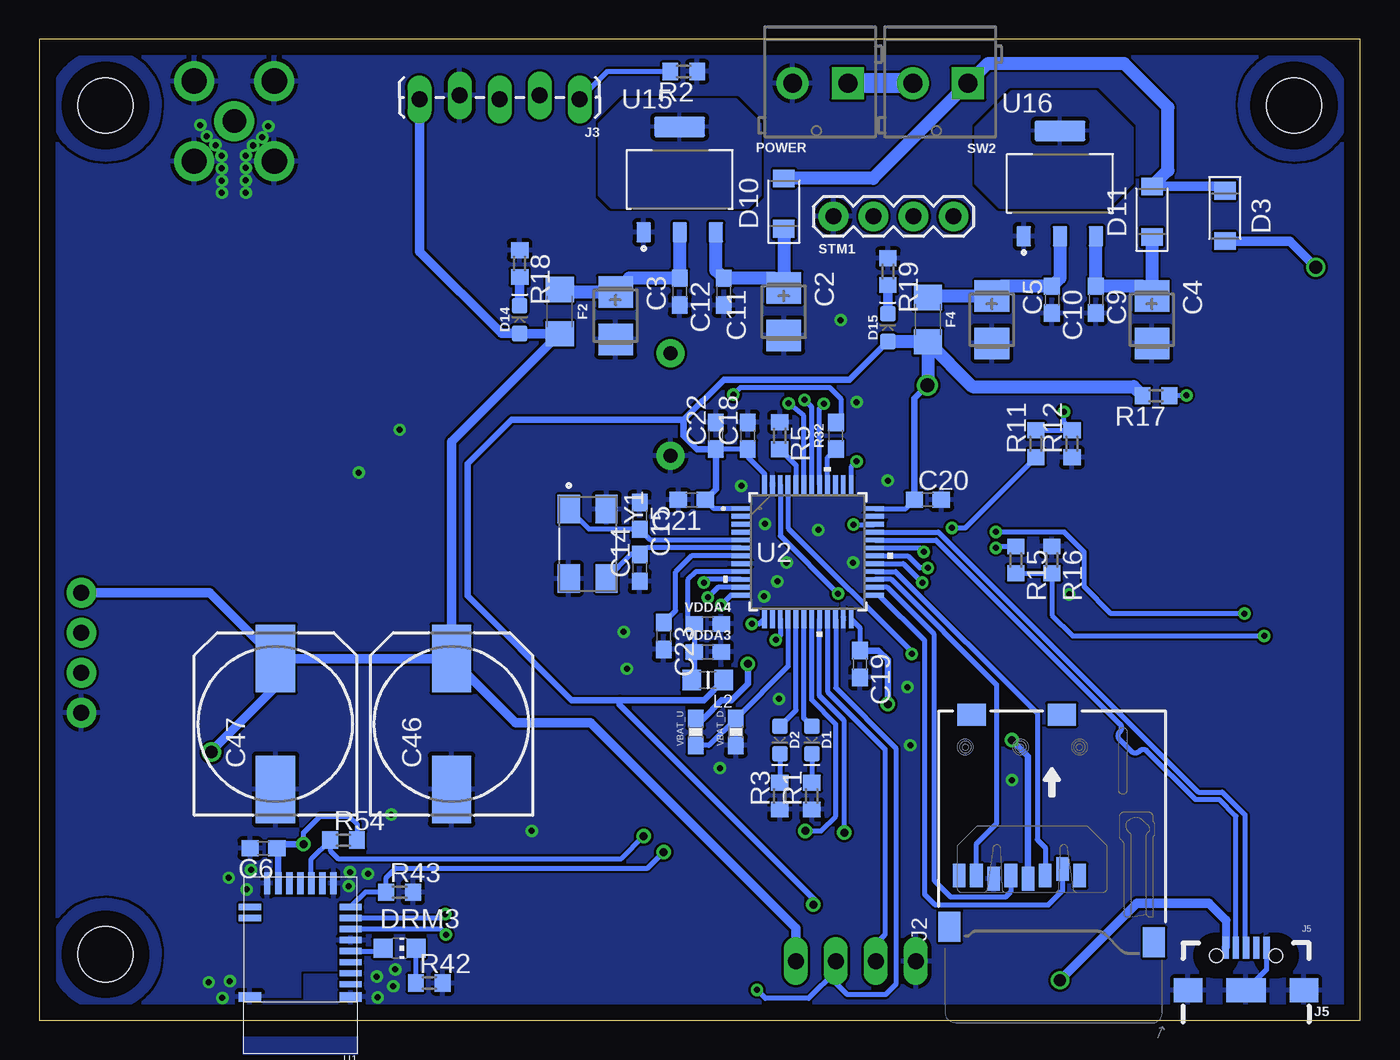
[diagram p6: board, bottom side, seen from below]

Size 83.82 x 62.23 mm. Coordinates in mm from the lower left corner, seen from the top.
Outline: 0,62.23 83.82,62.23 83.82,0 0,0 0,62.23
Copper layers (1*16): Top 0.035mm / dielectric 1.5mm / Bottom 0.035mm
Design rules "default": minimum track width 6mil, minimum drill 0.35mm, track to track 6mil, track to pad 6mil, pad to pad 6mil, via to via 6mil, smd to smd 6mil, copper to edge 40mil, drill to drill 6mil, minimum pad ring 10mil, minimum via ring 8mil, stop-mask expansion 4mil, vias tented up to drill 0mil, thermal gap 10mil
Holes 3.5 mm at 4.19,58.04 79.63,58.04 79.63,4.19

### Footprints (pad centres in the part's own frame; a part is rotated, then mirrored left to right if it is on the bottom)
BATTCON-6.8MM = smd 2.25 x 0.85: + 4.87,0.75; - 4.87,-0.75
C0603 = smd 1.1 x 1: 1 -0.85,0; 2 0.85,0
CT3528 = smd 2 x 2.2: + -1.5,0; - 1.5,0
A/3216-18R = smd 1.95 x 1.5: + 1.375,0; - -1.375,0
EIA3216 = smd 1.4 x 1.6: + 1.4,0; - -1.4,0
150CLZ-1010 = smd 4.3 x 2.5: + 4.15,0; - -4.15,0
LED-0603 = smd 1 x 1: A -0.877,0; C 0.877,0
SODFL3718X115 = smd 1.115 x 1.361: 1 -1.6,0; 2 1.6,0
SOD-323 = smd 0.63 x 0.83: A 1.15,0; C -1.15,0
CHIP-LED0805 = smd 1.2 x 1.2: A 0,-1.05; C 0,1.05
1206 = smd 1.6 x 1.8: 1 -1.4,0; 2 1.4,0
1X04 = drill 1.016 pad 1.88: 1 0,0; 2 2.54,0; 3 5.08,0; 4 7.62,0
CON-SD-CARD_2908-05 = smd 0.8 x 1.5: 1 1.761,3.847; 2 0.669,4.253; 3 -0.423,3.847; 4 -1.515,3.644; 5 -2.607,3.847; 6 -3.7,3.644; 7 -4.792,3.847; 8 -5.884,3.847 | smd 1.397 x 1.905: GND@1 -6.5,0.6; GND@2 6.473,-0.389 | smd 1.803 x 1.397: GND@3 0.631,14.059; GND@4 -5.084,14.059
1X05_LOCK_LONGPADS = drill 1.016 long: 1 0,0; 2 2.54,-0.254; 3 5.08,0; 4 7.62,-0.254; 5 10.16,0
U.FL = smd 2.2 x 0.85: 1 0,1.375; 2 0,-1.375 | smd 1.05 x 1: FEED 1.525,0; NC -1.525,0
USB-AB-MICRO-SMD = smd 1.4 x 0.4: D+1 2.7,0; D-1 2.7,0.65; GND1 2.7,-1.3; ID1 2.7,-0.65; VBUS1 2.7,1.3 | smd 1.5 x 1.8: SHLD1 0,-3.68; SHLD2 0,3.68 | smd 1.5 x 2.5: SHLD3 0,0 | hole 0.85: 2.2,1.9; 2.2,-1.9
RC-MASTER-SMD_L0805MP = smd 1.2 x 1.3: 1 -1.016,0; 2 1.016,0
BUZZER-12MM = drill 0.9 pad 1.778: + 3.25,0; - -3.25,0
SCREWTERMINAL-3.5MM-2-NS = drill 1.2 pad 2.032 square: 1 0,0 | drill 1.2 pad 2.032: 2 3.5,0
R0603 = smd 1 x 1.1: 1 -0.85,0; 2 0.85,0
0603 = smd 1.1 x 1: 1 -0.85,0; 2 0.85,0
SMS-004 = smd 1.092 x 2.007: 1 -3.81,-4.496; 2 -1.27,-4.496; 3 1.27,-4.496; 4 3.81,-4.496; 5 3.81,4.496; 6 1.27,4.496; 7 -1.27,4.496; 8 -3.81,4.496
MDBT42T-AT = smd 0.4 x 1.4: ADC -1.5,-4.7; CTS 0.6,-4.7; FLASH-D -0.8,-4.7; GND@1 -2.2,-4.7; GND@2 2,-4.7; RTS -0.1,-4.7; VDD 1.3,-4.7 | smd 1.4 x 0.4: DCC 3.1,-3.2; DEC4 3.1,-2.5; IND -3.3,-0.4; NC@0 -3.3,1.7; NC@1 -3.3,1; RESET -3.3,0.3; RX -3.3,-2.5; TX -3.3,-1.8; UART-PD -3.3,-3.2; WAKE-UP -3.3,-1.1 | smd 1.4 x 0.6: GND@0 -3.3,2.5; GND@3 3.1,2.5
LQFP48-7X7MM = smd 1.194 x 0.305: 1 -4.25,2.75; 2 -4.25,2.25; 3 -4.25,1.75; 4 -4.25,1.25; 5 -4.25,0.75; 6 -4.25,0.25; 7 -4.25,-0.25; 8 -4.25,-0.75; 9 -4.25,-1.25; 10 -4.25,-1.75; 11 -4.25,-2.25; 12 -4.25,-2.75; 25 4.25,-2.75; 26 4.25,-2.25; 27 4.25,-1.75; 28 4.25,-1.25; 29 4.25,-0.75; 30 4.25,-0.25; 31 4.25,0.25; 32 4.25,0.75; 33 4.25,1.25; 34 4.25,1.75; 35 4.25,2.25; 36 4.25,2.75 | smd 0.305 x 1.194: 13 -2.75,-4.25; 14 -2.25,-4.25; 15 -1.75,-4.25; 16 -1.25,-4.25; 17 -0.75,-4.25; 18 -0.25,-4.25; 19 0.25,-4.25; 20 0.75,-4.25; 21 1.25,-4.25; 22 1.75,-4.25; 23 2.25,-4.25; 24 2.75,-4.25; 37 2.75,4.25; 38 2.25,4.25; 39 1.75,4.25; 40 1.25,4.25; 41 0.75,4.25; 42 0.25,4.25; 43 -0.25,4.25; 44 -0.75,4.25; 45 -1.25,4.25; 46 -1.75,4.25; 47 -2.25,4.25; 48 -2.75,4.25
XCVR_L86 = smd 2.5 x 1: 1 -7.75,6.35; 2 -7.75,3.81; 3 -7.75,1.27; 4 -7.75,-1.27; 5 -7.75,-3.81; 6 -7.75,-6.35; 7 7.75,-6.35; 8 7.75,-3.81; 9 7.75,-1.27; 10 7.75,1.27; 11 7.75,3.81; 12 7.75,6.35
E32-868T30S = smd 3.81 x 1.905: 3V3 12.3,5.08; AUX -12.7,7.62; GND@0 -12.7,12.7; GND@1 12.3,10.16; M0 -12.7,-2.54; M1 -12.7,0; PB0 12.3,-2.54; PB1 12.3,0; PB3 12.3,2.54; RST 12.3,12.7; RX -12.7,2.54; SWIM 12.3,7.62; TX -12.7,5.08; VCC -12.7,10.16 | smd 1.905 x 3.81: ANT -6.97,-22.86; GND@2 6.57,-22.91; GND@3 4.03,-22.91; GND@4 -4.43,-22.86
SOT229P700X180-4N = smd 0.93 x 1.31: 1 -2.29,-3.345; 2 0,-3.345; 3 2.29,-3.345 | smd 3.24 x 1.31: 4 0,3.345
0603-RES = smd 1.1 x 1: 1 -0.85,0; 2 0.85,0
SMA90_DIP = drill 1.5 pad 2.54: ANTENNA 0,0 | drill 1.6 pad 2.54: GND1 -2.54,2.54; GND2 2.54,2.54; GND3 -2.54,-2.54; GND4 2.54,-2.54
JST-XH-04-PACKAGE-LONG-PAD = drill 1.016 long: 1 -3.81,0; 2 -1.27,0; 3 1.27,0; 4 3.81,0
XTAL_ABMM2-8.000MHZ-E2-T = smd 1.8 x 1.4: 1 -2.2,-1.2; 2 2.2,-1.2; 3 2.2,1.2; 4 -2.2,1.2

### Placement (x,y rotation side)
B1  18.42,9.91 180 top
C1  10.16,19.56 180 top
C2  36.58,44.96 270 bottom
C3  47.24,44.7 270 bottom
C4  13.21,44.45 270 bottom
C5  23.37,44.45 270 bottom
C6  69.6,10.92 180 bottom
C9  16.76,45.72 270 bottom
C10  19.56,45.72 270 bottom
C11  40.39,46.23 270 bottom
C12  43.18,46.23 270 bottom
C14  45.72,28.7 90 bottom
C15  45.72,32 270 bottom
C16  9.91,47.24 0 top
C17  9.91,44.2 0 top
C18  38.86,37.08 90 bottom
C19  31.75,22.61 270 bottom
C20  27.43,33.02 0 bottom
C21  42.42,33.02 180 bottom
C22  40.89,37.08 90 bottom
C23  44.2,24.38 270 bottom
C24  15.75,18.54 0 top
C26  15.75,15.75 180 top
C42  9.4,16.51 0 top
C46  57.66,18.8 90 bottom
C47  68.83,18.8 90 bottom
D1  34.8,17.78 270 bottom
D2  36.83,17.78 270 bottom
D3  8.59,51.03 270 bottom
D10  36.58,51.82 90 bottom
D11  13.21,51.31 90 bottom
D12  9.91,13.97 0 top
D13  20.57,15.24 270 top
D14  53.34,44.45 90 bottom
D15  29.97,43.94 90 bottom
D16  14.99,48.51 90 top
D17  38.35,17.02 270 top
DRM3  60.96,4.57 270 bottom
F2  50.8,44.96 270 bottom
F4  27.43,44.45 270 bottom
J1  81.15,19.51 90 top
J2  19.56,5.33 0 bottom
J3  49.53,58.42 180 bottom
J4  7.11,50.8 270 top
J5  7.24,1.91 90 bottom
L2  41.4,21.59 180 bottom
LS1  43.76,39.07 90 top
POWER  32.51,59.44 180 bottom
R1  34.8,14.22 90 bottom
R2  42.93,60.2 180 bottom
R3  36.83,14.22 90 bottom
R4  7.11,45.72 270 top
R5  36.83,37.08 270 bottom
R6  47.93,15.29 270 top
R7  45.69,15.32 270 top
R8  35.1,15.77 270 top
R9  32.82,15.77 270 top
R11  20.57,36.58 90 bottom
R12  18.29,36.58 90 bottom
R13  14.99,44.7 270 top
R14  20.57,19.05 90 top
R15  21.84,29.21 270 bottom
R16  19.56,29.21 270 bottom
R17  12.95,39.62 180 bottom
R18  53.34,48.01 270 bottom
R19  29.97,47.5 270 bottom
R20  38.35,20.07 90 top
R32  33.27,37.08 90 bottom
R39  9.53,12.32 180 top
R42  59.08,2.36 0 bottom
R43  60.96,8.13 0 bottom
R54  64.52,11.43 0 bottom
S2  44.5,7.34 90 top
STM1  33.43,51 0 bottom
SW2  24.89,59.44 180 bottom
U1  67.36,3.99 180 bottom
U2  35.05,29.72 0 bottom
U13  11.18,31.75 90 top
U14  64.52,27.18 180 top
U15  43.18,53.34 0 bottom
U16  19.05,53.09 0 bottom
VBAT_D  39.62,18.29 90 bottom
VBAT_U  42.16,18.29 90 bottom
VDDA3  41.4,23.37 0 bottom
VDDA4  41.4,25.15 0 bottom
X1  71.45,57.05 0 top
X2  32,3.76 0 top
Y1  49.02,30.23 270 bottom

### Tracks (layer width: path | path; a pad name or v marks a point on that pad's centre or on a via)
3.3V  (via drill 0.51, 0.89)
  Top 0.305: U13.4 12.45,20.99 C1.1 11.01,16.72 C42.+ 11.06,16.25 D12.A | v29.97,20.07 29.97,19.47 R9.1 R8.1
  Top 0.406: C42.+ 12.19,16.51 13.72,18.03 13.72,25.4 14.22,25.91 18.54,25.91 22.1,22.35 v22.1,17.78 24.38,20.07 v29.97,20.07 29.97,8.38 30.99,7.37 34.67,7.37 v34.7,7.34 34.82,7.47 53.49,7.47 57.2,11.18 v67.06,11.18
  Top 0.813: v27.46,40.28 25.81,41.94 STM1.4
  Bottom 0.305: U2.36 28.83,32.47 C20.1 | U2.48 37.8,34.67 38.86,35.73 C18.1 C22.1 | U2.1 41.02,32.47 C21.1 | U2.24 31.75,24.92 C19.1 | v67.06,11.18 67.06,11.91 66.01,12.95 64.16,12.95 63.67,12.46 R54.2
  Bottom 0.406: D15.A 32.4,40.64 40.39,40.64 42.93,38.1 | 42.93,38.1 42.93,37.08 42.08,36.23 C22.1 40.89,33.69 C21.1 | 42.93,38.1 53.85,38.1 56.64,35.31 56.64,26.92 50.04,20.32 46.99,20.32 | 46.99,20.32 41.66,20.32 L2.1 | 46.99,20.32 46.99,20.02 34.7,7.72 v34.7,7.34 | v29.97,20.07 29.97,22.86 30.57,23.46 C19.1 | v22.1,17.78 21.07,16.76 J2.4 | v67.06,11.18 68.49,11.18 C6.1 68.66,10.84 U1.VDD | C20.1 28.28,39.46 27.43,40.31
  Bottom 0.813: F4.2 29.96,43.05 D15.A | F4.2 24.59,40.21 14.39,40.21 R17.2 | F4.2 27.43,40.31 v27.46,40.28
5V  (via drill 0.76, 0.81)
  Top 0.61: U14.VCC v72.9,17.02 | X2.4 35.81,2.62 34.72,1.52 20.07,1.52 v19.05,2.54 13.54,2.54 1.63,14.45 1.63,46.58 v2.82,47.78
  Bottom 0.508: 8.54,6.35 J5.VBUS1
  Bottom 0.61: C46.+ 57.66,36.7 F2.2 53.33,43.56 D14.A 54.5,43.57 59.69,48.77 J3.5 | C47.+ C46.+ | v72.9,17.02 72.9,17.1 68.83,21.17 C47.+ | C46.+ 53.59,18.88 48.85,18.88 35.81,5.84 X2.4 | v19.05,2.54 14.17,7.42 9.61,7.42 8.54,6.35 | v2.82,47.78 4.47,49.43 D3.2 | C47.+ 73.02,27.13 J1.4
AUX  (via drill 0.38)
  Top 0.305: v37.08,24.13 37.08,22.19 R20.2 38.43,20.84 71.11,20.84 72.39,19.56 U14.AUX
  Bottom 0.305: U2.15 36.8,24.41 v37.08,24.13
B1  (via drill 0.38)
  Top 0.305: S2.3 47.47,10.13 47.47,12.69 R7.2 45.43,14.2 37.74,14.2 36.55,15.39 36.55,17.32 35.31,18.57 33.12,18.57 v28.45,23.24
  Bottom 0.305: U2.45 36.3,31.22 28.45,23.37 v28.45,23.24
B2  (via drill 0.38)
  Top 0.305: S2.4 49,13.37 R6.2 47.03,15.34 44.91,15.34 44.35,14.78 38.02,14.78 37.16,15.65 37.16,17.53 33.13,21.55 v33.13,27.07
  Bottom 0.305: U2.46 36.8,30.73 v33.13,27.07
BT0
  Bottom 0.305: R5.2 35.8,35.21 U2.44
BZZR
  Bottom 0.305: U2.40 33.8,35.71 R32.1
CS
  Bottom 0.305: J2.2 18.89,8.2 19.78,7.32 26.97,7.32 27.64,7.98 27.64,24.08 30.52,26.97 U2.25
D1
  pour Top: 83.13,58.04 arc-90 79.6,54.53 arc-90 76.12,58.06 arc-90 79.63,61.54 arc-90
  pour Bottom: 76.12,58.01 arc90 79.6,54.53 arc90 83.13,58.06 arc90 79.58,61.54 arc90
D2
  pour Top: 7.7,58.04 arc-90 4.17,54.53 arc-90 0.69,58.06 arc-90 4.19,61.54 arc-90
  pour Bottom: 0.69,58.01 arc90 4.17,54.53 arc90 7.7,58.06 arc90 4.14,61.54 arc90
D3
  pour Top: 83.13,4.19 arc-90 79.6,0.69 arc-90 76.12,4.22 arc-90 79.63,7.7 arc-90
  pour Bottom: 76.12,4.17 arc90 79.6,0.69 arc90 83.13,4.22 arc90 79.58,7.7 arc90
DRDY  (via drill 0.38)
  Top 0.305: J3.1 49.53,54.61 v34.04,39.12
  Bottom 0.305: J3.1 47.75,60.2 R2.2 | U2.41 34.3,38.85 v34.04,39.12
FLASH-D  (via drill 0.51)
  Top 0.305: v45.47,11.68 43.48,13.67 36.86,13.67 v35.2,12.01
  Bottom 0.305: U1.FLASH-D 66.56,10.24 R54.1 65.37,10.76 64.87,10.26 46.89,10.26 v45.47,11.68 | v35.2,12.01 34.21,12.01 33.27,12.95 33.27,18.8 34.8,20.32 U2.19
FN  (via drill 0.38)
  Top 0.305: v27.79,27.76 28.7,28.67 28.7,30.48 27.94,31.24 v25.91,31.24
  Bottom 0.305: U2.29 29,28.97 v27.79,27.76 | v25.91,31.24 25.06,31.24 R11.1
GND  (via drill 0.38)
  Bottom 0.305: J5.GND1 5.94,3.21 J5.SHLD3
  other vias: 46.74,24.64 40.64,16 22.1,15.24 70.71,52.5 70.71,53.29 70.71,54.08 70.71,54.86 70.26,55.5 72.24,52.5 72.24,53.26 72.24,54.05 72.26,54.84 72.64,55.52 73.2,56.08 69.67,56.01 69.29,56.72 73.61,56.79 64.11,9.4 62.97,9.3 64.19,8.51 70.38,9.55 70.66,8.31 71.81,9.04 71.73,2.49 72.21,1.42 73.08,2.41 62.36,1.45 62.41,2.77 61.37,2.16 61.24,3.23 46.53,22.3 36.98,27.84 36.4,29.03 37.82,26.9 52.58,12.01 63.55,34.75 60.96,37.46 61.49,13.06 32.97,44.42 28.55,17.45 28.73,21.13 32.18,29.03 34.39,31.11 29.97,34.24 36.88,20.4 18.47,27.03 31.95,39.22 37.77,31.5 39.27,33.91
  pour Bottom (rank 2): -0.51,-0.51 -0.51,62.74 84.33,62.74 84.33,-0.51
  pour Top (rank 2): -1.02,-1.02 -1.02,63.25 84.84,63.25 84.84,-1.02
HT
  pour Bottom: 38.86,51.56 47.5,51.56 48.26,52.32 48.26,56.9 46.74,58.42 39.62,58.42 38.1,56.9 38.1,52.32
HT2
  pour Bottom: 16,51.56 22.86,51.56 24.38,53.09 24.38,56.64 22.1,58.93 16.76,58.93 14.48,56.64 14.48,53.09
LED
  Bottom 0.305: U2.18 35.3,19.16 D1.A
LED2
  Bottom 0.305: U2.17 35.8,19.69 D2.A
M0  (via drill 0.38)
  Top 0.305: v41.66,27.77 43.26,27.77 46.48,30.99 71.12,30.99 72.39,29.72 U14.M0
  Bottom 0.305: U2.10 41.46,27.97 v41.66,27.77
M1  (via drill 0.38)
  Top 0.305: v41.4,26.83 45.53,26.83 47.14,28.44 51.8,28.44 51.82,28.45 71.12,28.45 72.39,27.18 U14.M1
  Bottom 0.305: U2.11 40.76,27.47 v41.4,26.83
MISO
  Bottom 0.305: J2.7 24.35,11.21 23.08,12.48 23.08,21.3 29.75,27.97 U2.27
MOSI
  Bottom 0.305: U2.28 29.48,28.47 20.49,19.47 20.49,11.47 19.98,10.96 J2.3
N$1
  Bottom 0.305: D1.C R1.2
N$2
  Top 0.305: D16.A R13.1
N$3
  Bottom 0.305: D2.C R3.2
N$4  (via drill 0.38)
  Top 0.305: v39.78,39.7 42.39,42.32 LS1.+
  Bottom 0.305: R32.2 32.92,38.29 32.92,39.4 33.66,40.13 39.34,40.13 v39.78,39.7
N$5
  Bottom 0.305: U1.IND 62.19,4.39 DRM3.A
N$6
  Bottom 0.305: DRM3.C 59.93,4.55 R42.1
N$7
  Top 0.305: R9.2 31.28,14.92 31.24,14.96 30.7,14.41 30.7,9.54 31.62,8.61 S2.6
N$8
  Top 0.305: S2.5 38.71,11.15 36.88,9.32 32.23,9.32 31.27,10.29 31.27,12.88 31.85,13.46 34.34,13.46 35.1,14.22 R8.2
N$22
  Bottom 0.813: D10.1 C2.+ 37.2,47.08 C11.1 40.89,47.58 U15.3
N$23
  Bottom 0.813: U15.2 C12.1 46.37,47.08 C3.+ 50.65,46.2 F2.1
N$24
  Bottom 0.813: D11.1 C4.+ 13.83,46.57 C9.1 U16.3
N$25
  Bottom 0.813: U16.2 19.05,47.08 C10.1 22.75,46.57 C5.+ 27.33,45.95 F4.1
N$27
  Top 0.406: X1.ANTENNA 71.49,57.01 U14.ANT
N$30
  Bottom 1.27: SW2.2 POWER.1
N$31
  Top 0.305: D12.C 8.76,12.4 R39.2
N$32  (via drill 0.38)
  Top 0.305: v11.02,39.65 10.06,39.65 U13.10
  Bottom 0.305: R17.1 12.08,39.65 v11.02,39.65
N$33
  Top 0.305: U13.6 20.57,20.95 R14.2
N$34
  Top 0.305: R14.1 D13.A
N$35
  Bottom 0.61: D14.C R18.2
N$36
  Bottom 0.61: D15.C R19.2
N$37
  Top 0.305: R13.2 U13.8
N$39
  Top 0.305: J4.FEED R4.1 7.79,47.24 C16.1
N$40  (via drill 0.38)
  Top 0.305: v18.8,38.61 17.9,39.5 U13.7
  Bottom 0.305: v18.8,38.61 18.8,37.93 R12.2 R11.2
N$41
  Top 0.305: R20.1 D17.A
NGND
  pour Bottom: 64.74,2.9 66.98,2.9 66.98,1.19 70.87,1.19 70.87,-2.11 63.65,-2.11 63.65,1.17 64.74,1.17
  pour Top: 64.74,2.9 66.98,2.9 66.98,1.19 70.87,1.19 70.87,-2.11 63.65,-2.11 63.65,1.17 64.74,1.17
NRST
  Bottom 0.305: U2.7 42.42,29.46 43.43,28.45 43.43,26 C23.1
OSC_IN
  Bottom 0.305: Y1.1 48.95,31.15 C15.2 45.03,30.47 U2.5
OSC_OUT
  Bottom 0.305: Y1.3 46.3,29.55 C14.2 45.3,29.97 U2.6
RX1  (via drill 0.38)
  Top 0.305: v7.34,25.81 7.34,24.03 U13.2 | v27.69,29.72 27.06,29.72 26.35,30.43 23.67,30.43 v23.11,30.99
  Bottom 0.305: U2.31 27.94,29.97 v27.69,29.72 | v23.11,30.99 18.8,30.99 17.51,29.71 17.51,27.5 15.82,25.81 v7.34,25.81
RX2  (via drill 0.38)
  Top 0.305: v38.61,25.15 40.39,23.37 71.12,23.37 72.39,22.1 U14.TX 81.1,22.1 J1.2
  Bottom 0.305: U2.13 38.12,25.15 v38.61,25.15
RX3  (via drill 0.38)
  Top 0.305: v38.28,1.93 39.88,3.53 S2.8
  Bottom 0.305: U2.22 33.27,25.44 33.27,21.08 29.46,17.27 29.46,2.29 30.12,1.63 32.54,1.63 33.27,2.36 X2.3 33.27,3.12 35,1.4 37.74,1.4 v38.28,1.93
RX3D  (via drill 0.38)
  Top 0.305: v58.01,5.44 56.11,3.53 S2.1
  Bottom 0.305: v58.01,5.44 58.01,5.49 58.32,5.79 U1.TX
SCK
  Bottom 0.305: J2.5 22.17,8.17 22.5,7.83 26,7.83 27.03,8.86 27.03,24.49 30.01,27.47 U2.26
SCL  (via drill 0.38)
  Top 0.305: v35.27,39.36 50.8,54.89 50.8,60.45 51.31,60.96 53.59,60.96 54.61,59.94 J3.3
  Bottom 0.305: U2.42 34.8,38.89 v35.27,39.36
SDA  (via drill 0.38)
  Top 0.305: v36.27,39.14 36.27,39.45 36.4,39.6 52.07,55.27 J3.2
  Bottom 0.305: U2.43 35.3,38.35 v36.27,39.14
SWCLK  (via drill 0.38)
  Top 0.305: STM1.2 30.89,36.53 v31.95,35.46
  Bottom 0.305: v31.95,35.46 32.3,35.11 U2.37
SWDIO  (via drill 0.38)
  Top 0.305: STM1.3 30.33,49.02 30.33,35.53 32.16,33.71 v32.16,31.45
  Bottom 0.305: v32.16,31.45 30.82,31.45 U2.34
TX1  (via drill 0.38)
  Top 0.305: v27.43,28.7 26.16,29.97 v23.11,29.97
  Bottom 0.305: U2.30 28.71,29.47 27.94,28.7 v27.43,28.7 | v23.11,29.97 23.03,30.06 R15.1
TX2  (via drill 0.38)
  Top 0.305: v40.56,26.34 40.99,25.91 71.12,25.91 72.39,24.64 U14.RX 81.1,24.64 J1.3
  Bottom 0.305: U2.12 39.93,26.97 v40.56,26.34
TX3
  Top 0.305: X2.2 30.73,4.52 32.28,6.07 S2.7
  Bottom 0.305: U2.21 33.8,20.85 30.15,17.2 30.15,5.44 30.73,4.85 X2.2
TX3D  (via drill 0.38)
  Top 0.305: v58.06,6.73 55.58,6.73 54.92,6.07 S2.2
  Bottom 0.305: v58.06,6.73 58.31,6.49 U1.RX
TXD  (via drill 0.38)
  Top 0.305: v6.1,24.38 5.21,24.38 U13.1
  Bottom 0.305: R15.2 R16.2 19.56,25.7 18.24,24.38 v6.1,24.38
UART-PD  (via drill 0.51)
  Top 0.305: v44.2,10.67 42.19,12.67 37.44,12.67 35.66,10.9 33.71,10.9 32.74,11.86 v32.74,11.91
  Bottom 0.305: U1.UART-PD 63.12,8.13 R43.1 61.81,9.06 61.21,9.65 45.21,9.65 v44.2,10.67 | v32.74,11.91 32.77,11.91 32.77,19.05 34.3,20.59 U2.20
USB_N
  Bottom 0.305: U2.32 26.91,30.47 15.24,18.8 arc90 15.24,18.31 15.26,18.29 arc-90 15.26,17.81 14.51,17.06 arc-90 14.03,17.06 14.01,17.08 arc90 13.52,17.08 10.46,14.02 8.94,14.02 7.87,12.95 7.87,4.62 J5.D-1
USB_P
  Bottom 0.305: U2.33 26.77,30.97 10.28,14.48 8.75,14.48 7.29,13.02 7.29,4.66 J5.D+1
V_BCKP
  Top 0.305: B1.+ 11.67,9.16 10.92,9.91 10.92,11.77 R39.1 10.94,12.32 C26.+ 14.9,16.27 C24.1 14.9,23.91 U13.5
VB
  Bottom 0.305: U2.16 36.3,22.46 VBAT_D.2 41.32,17.44 VBAT_U.1
VCC  (via drill 0.51)
  Top 0.406: SW2.1 25.65,59.44 28.51,56.58 32.14,56.58 36.7,52.02 36.7,45.36 33.02,41.68 33.02,29.67 38.86,23.83 v38.86,22.61
  Bottom 0.406: v38.86,22.61 38.86,21.34 39.9,20.3 40.53,20.3 41.68,19.14 VBAT_U.2
  Bottom 0.61: D3.1 8.86,52.91 D11.2
  Bottom 0.813: D10.2 30.91,53.42 SW2.1 23.62,60.71 14.99,60.71 12.19,57.91 12.19,53.92 D11.2
VDDA
  Bottom 0.305: U2.9 42.14,28.47 42.67,27.94 42.67,25.57 VDDA4.1 VDDA3.1 42.25,21.76 L2.2
XANT
  Top 0.305: U13.11 7.11,39.75 R4.2 7.79,44.2 C17.1

### Text on the board
tPlace: G | DR | DA | CL | 5V | 3.3 | IO | CLK | GND | 5V | TX2 | RX2 | G | GND | TX3 | RX3 | 5V